# EAGLE schematic Specialist (EAGLE 6.4)

## Sheet 1 of 9
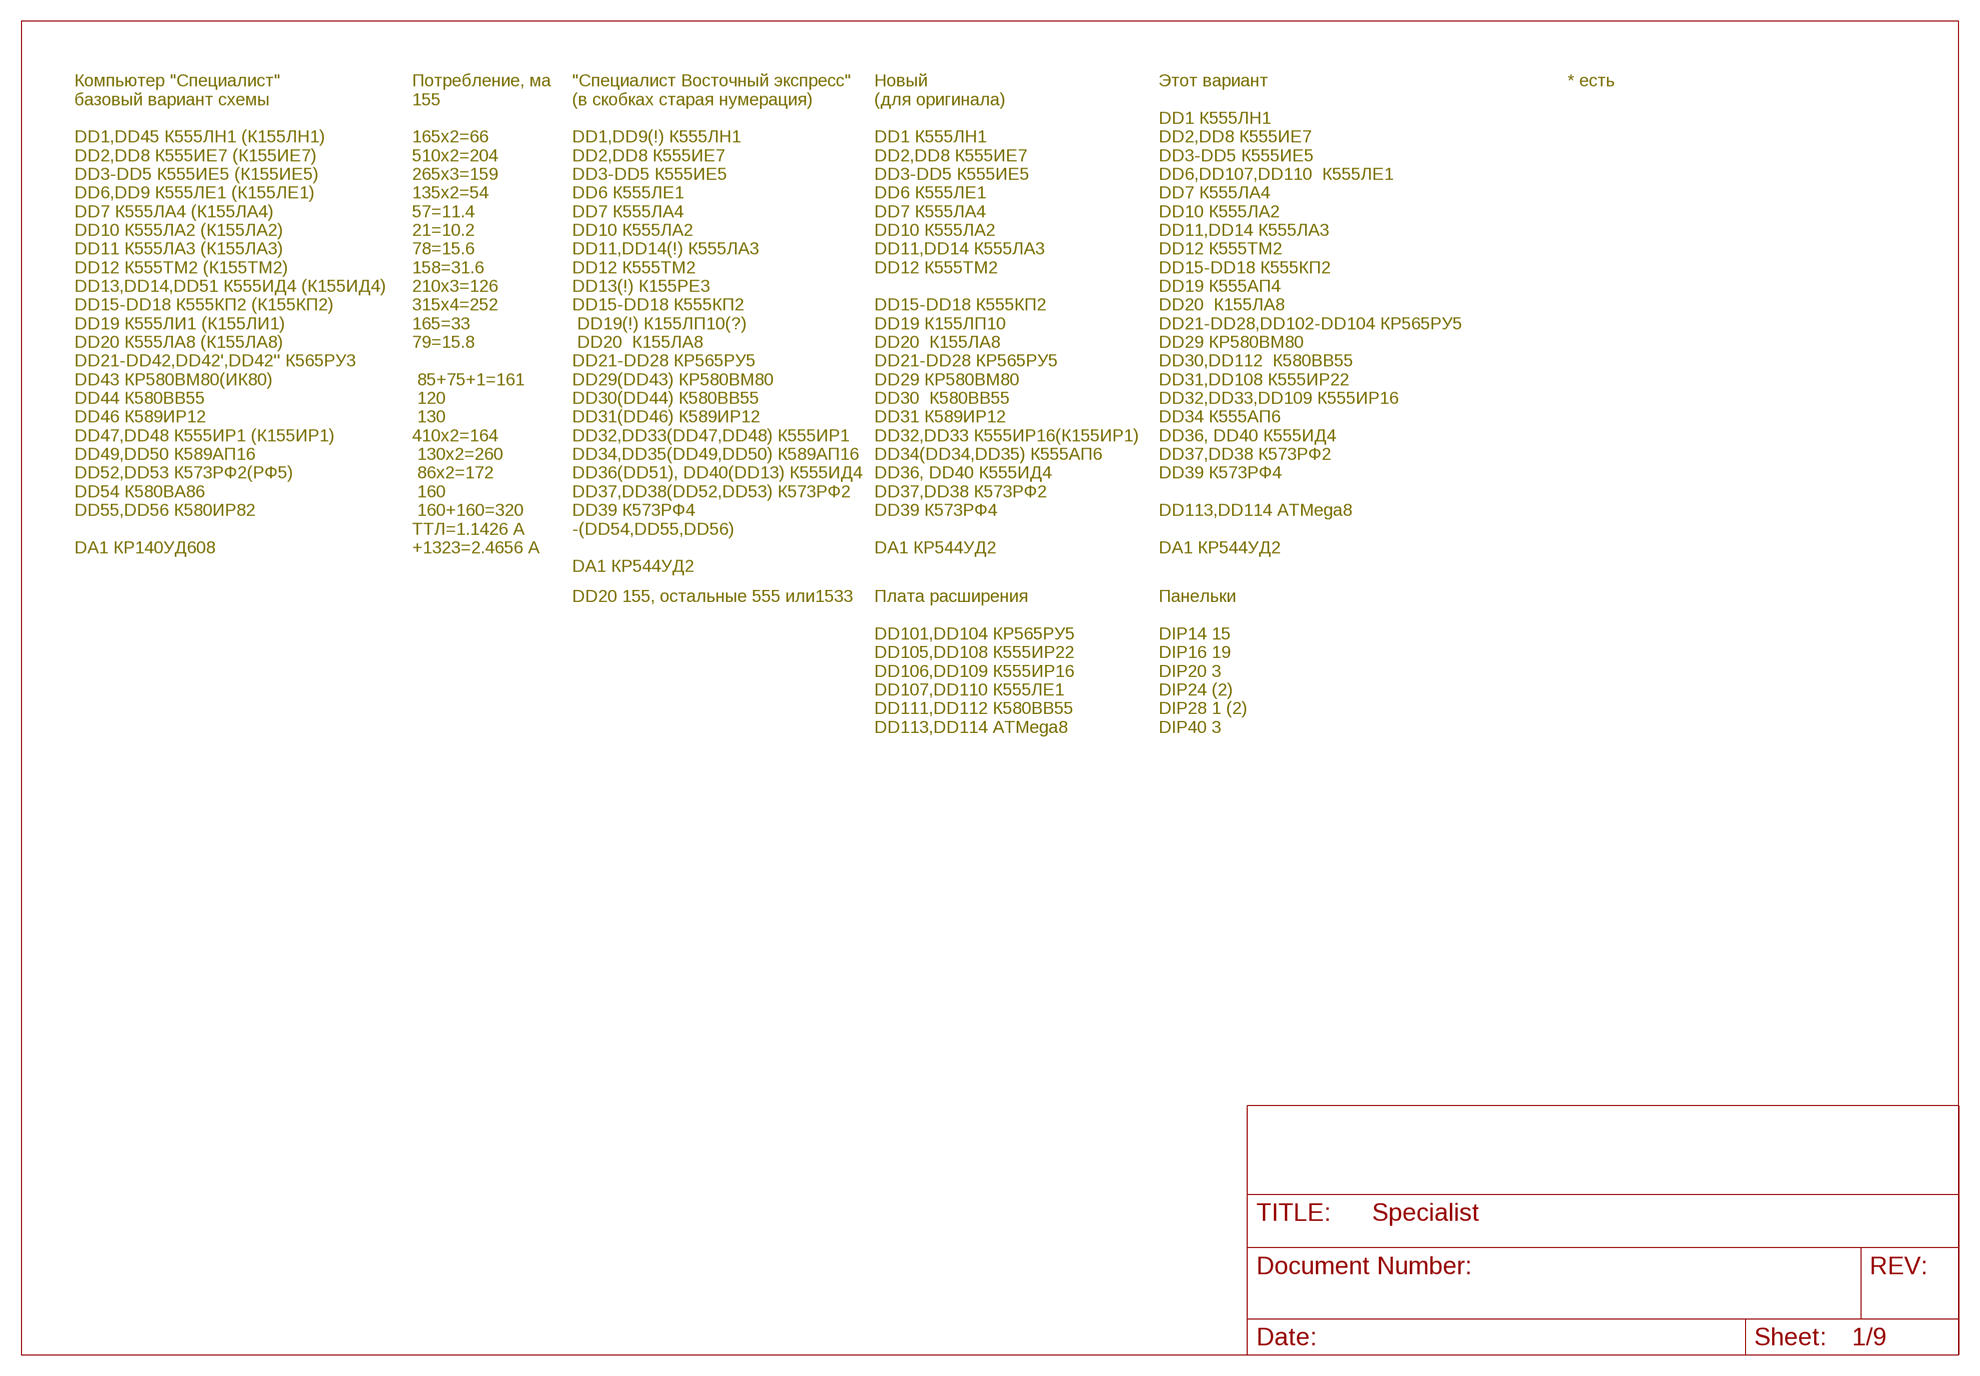
[diagram p0: schematic, sheet 1]

### Notes on the sheet
- Компьютер "Специалист"
  базовый вариант схемы
  
  DD1,DD45 К555ЛН1 (К155ЛН1)
  DD2,DD8 К555ИЕ7 (К155ИЕ7)
  DD3-DD5 К555ИЕ5 (К155ИЕ5)
  DD6,DD9 К555ЛЕ1 (К155ЛЕ1)
  DD7 К555ЛА4 (К155ЛА4)
  DD10 К555ЛА2 (К155ЛА2)
  DD11 К555ЛА3 (К155ЛА3)
  DD12 К555ТМ2 (К155ТМ2)
  DD13,DD14,DD51 К555ИД4 (К155ИД4)
  DD15-DD18 К555КП2 (К155КП2)
  DD19 К555ЛИ1 (К155ЛИ1)
  DD20 К555ЛА8 (К155ЛА8)
  DD21-DD42,DD42',DD42'' К565РУ3
  DD43 КР580ВМ80(ИК80)
  DD44 К580ВВ55
  DD46 К589ИР12
  DD47,DD48 К555ИР1 (К155ИР1)
  DD49,DD50 К589АП16
  DD52,DD53 К573РФ2(РФ5)
  DD54 К580ВА86
  DD55,DD56 К580ИР82
  
  DA1 КР140УД608
- Потребление, ма
  155 
  
  165х2=66
  510х2=204
  265х3=159
  135х2=54
  57=11.4
  21=10.2
  78=15.6
  158=31.6
  210х3=126
  315х4=252
  165=33
  79=15.8
  
   85+75+1=161
   120
   130
  410х2=164
   130х2=260
   86х2=172
   160
   160+160=320
  ТТЛ=1.1426 А
  +1323=2.4656 А
- "Специалист Восточный экспресс"
  (в скобках старая нумерация)
  
  DD1,DD9(!) К555ЛН1
  DD2,DD8 К555ИЕ7
  DD3-DD5 К555ИЕ5
  DD6 К555ЛЕ1
  DD7 К555ЛА4
  DD10 К555ЛА2
  DD11,DD14(!) К555ЛА3
  DD12 К555ТМ2
  DD13(!) К155РЕ3
  DD15-DD18 К555КП2
   DD19(!) К155ЛП10(?)
   DD20  К155ЛА8
  DD21-DD28 КР565РУ5
  DD29(DD43) КР580ВМ80
  DD30(DD44) К580ВВ55
  DD31(DD46) К589ИР12
  DD32,DD33(DD47,DD48) К555ИР1
  DD34,DD35(DD49,DD50) К589АП16
  DD36(DD51), DD40(DD13) К555ИД4 
  DD37,DD38(DD52,DD53) К573РФ2
  DD39 К573РФ4
  -(DD54,DD55,DD56)
  
  DA1 КР544УД2
- Новый
  (для оригинала)
  
  DD1 К555ЛН1
  DD2,DD8 К555ИЕ7
  DD3-DD5 К555ИЕ5
  DD6 К555ЛЕ1
  DD7 К555ЛА4
  DD10 К555ЛА2
  DD11,DD14 К555ЛА3
  DD12 К555ТМ2
  
  DD15-DD18 К555КП2
  DD19 К155ЛП10
  DD20  К155ЛА8
  DD21-DD28 КР565РУ5
  DD29 КР580ВМ80
  DD30  К580ВВ55
  DD31 К589ИР12
  DD32,DD33 К555ИР16(К155ИР1)
  DD34(DD34,DD35) К555АП6
  DD36, DD40 К555ИД4 
  DD37,DD38 К573РФ2
  DD39 К573РФ4
  
  DA1 КР544УД2
- Этот вариант
  
  DD1 К555ЛН1
  DD2,DD8 К555ИЕ7
  DD3-DD5 К555ИЕ5
  DD6,DD107,DD110  К555ЛЕ1
  DD7 К555ЛА4
  DD10 К555ЛА2
  DD11,DD14 К555ЛА3
  DD12 К555ТМ2
  DD15-DD18 К555КП2
  DD19 К555АП4
  DD20  К155ЛА8
  DD21-DD28,DD102-DD104 КР565РУ5
  DD29 КР580ВМ80
  DD30,DD112  К580ВВ55
  DD31,DD108 К555ИР22
  DD32,DD33,DD109 К555ИР16
  DD34 К555АП6
  DD36, DD40 К555ИД4 
  DD37,DD38 К573РФ2
  DD39 К573РФ4
  
  DD113,DD114 ATMega8
  
  DA1 КР544УД2
- * есть
- DD20 155, остальные 555 или1533
- Плата расширения
  
  DD101,DD104 КР565РУ5
  DD105,DD108 К555ИР22
  DD106,DD109 К555ИР16
  DD107,DD110 К555ЛЕ1
  DD111,DD112 К580ВВ55
  DD113,DD114 ATMega8
- Панельки
  
  DIP14 15
  DIP16 19
  DIP20 3
  DIP24 (2)
  DIP28 1 (2)
  DIP40 3

## Sheet 2 of 9: PWR
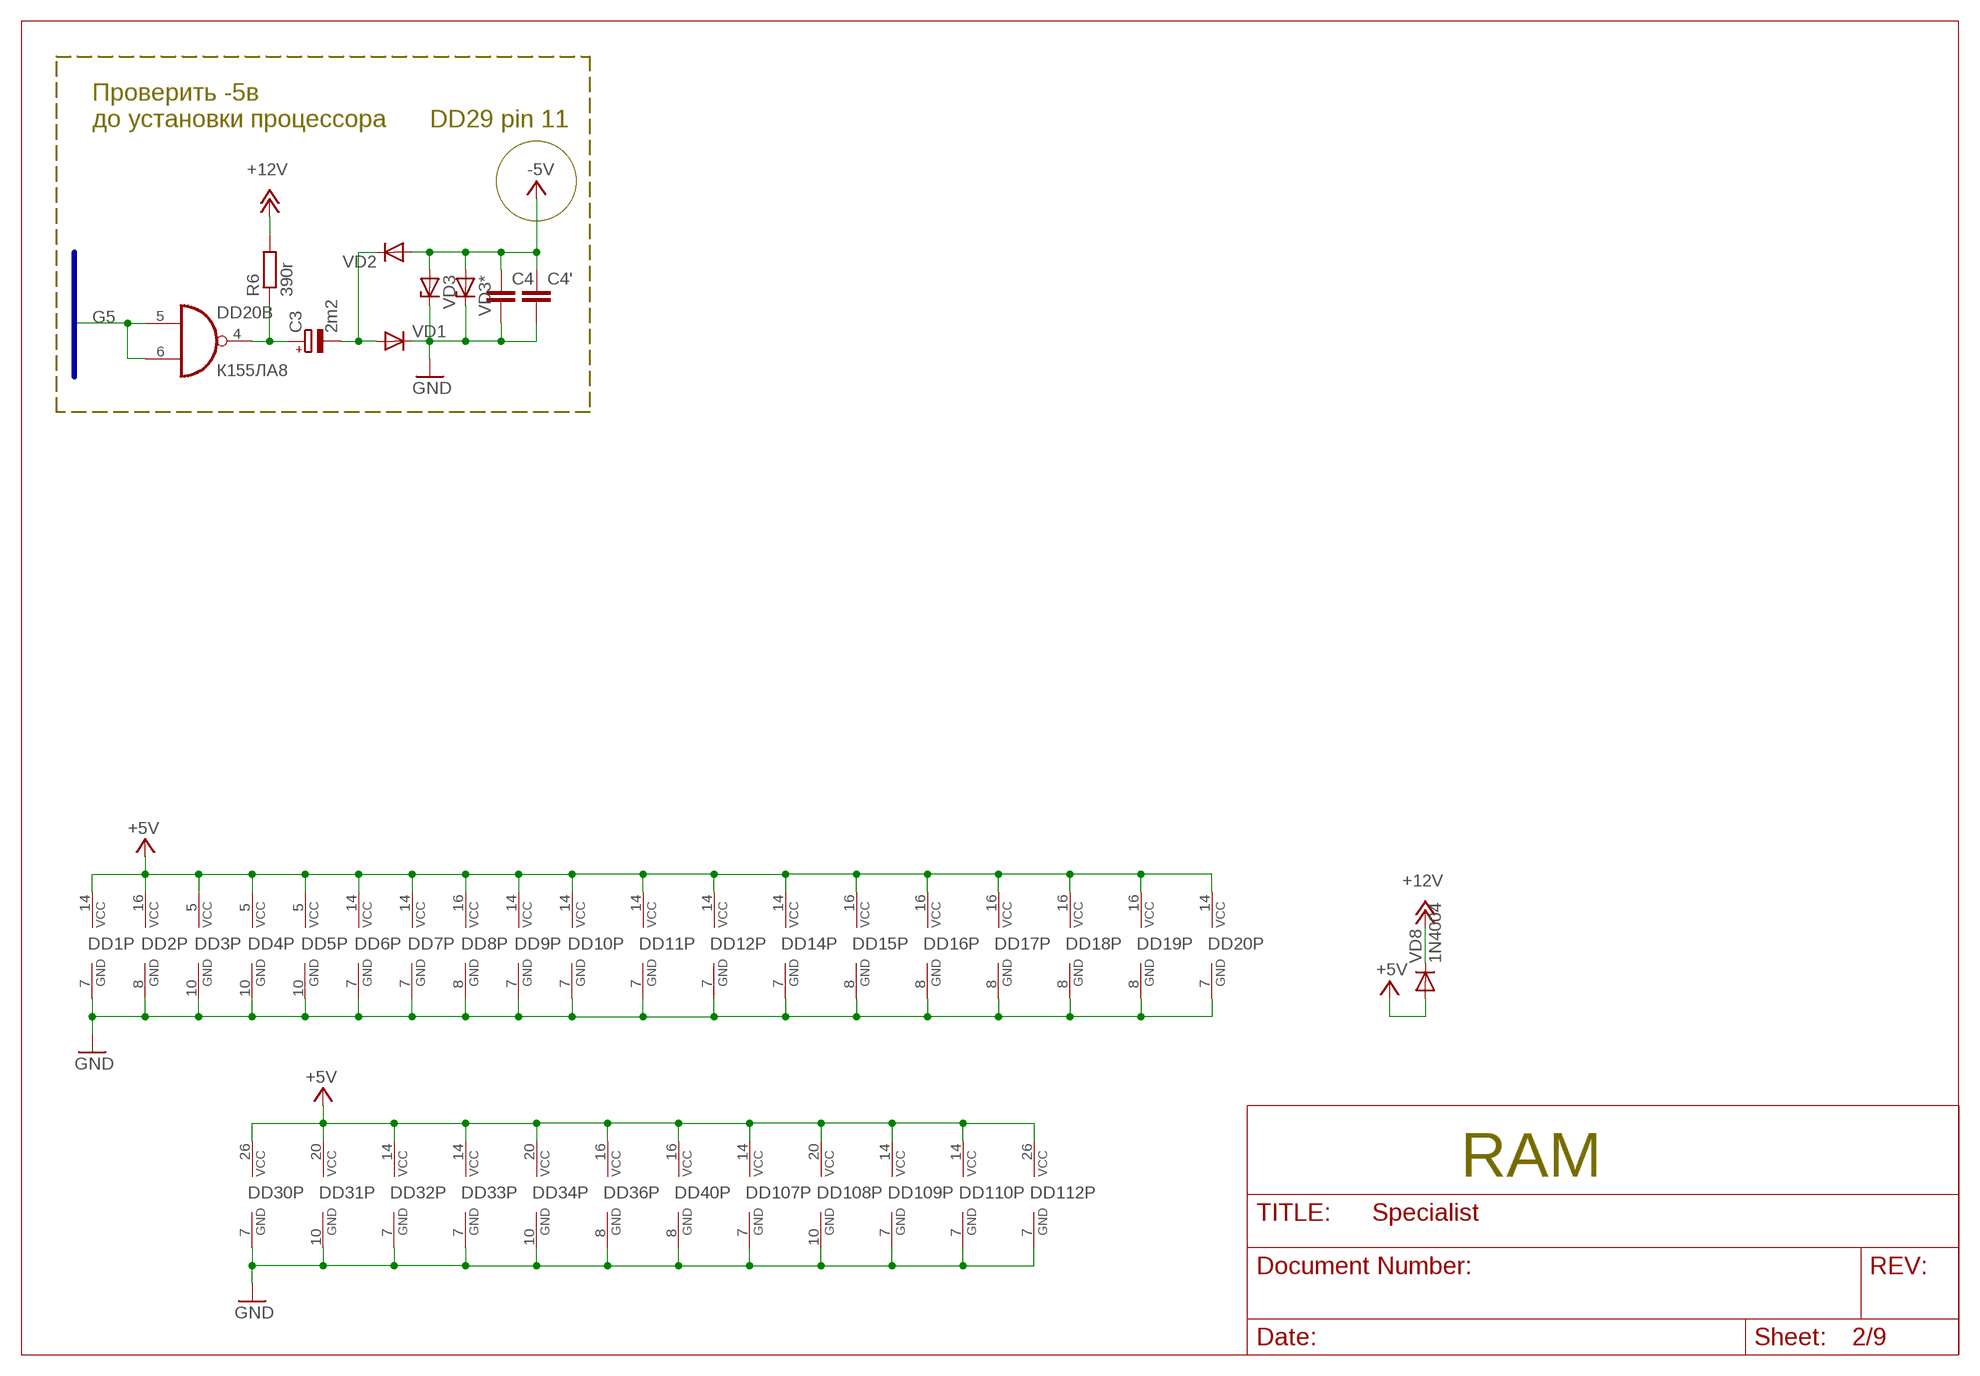
[diagram p1: schematic, sheet 2]

### Parts
C3  2m2  CPOL-EUE2.5-5  [E2,5-5]
C4  C-EUC1206  [C1206]
C4'  C-EUC1206  [C1206]
DD1  К155ЛН1  7404N  [DIL14]
DD2  К155ИЕ7  74192N  [DIL16]
DD3  К155ИЕ5  74LS93N  [DIL14]
DD4  К155ИЕ5  74LS93N  [DIL14]
DD5  К155ИЕ5  74LS93N  [DIL14]
DD6  К155ЛЕ1  7402N  [DIL14]
DD7  К155ЛА4  7410N  [DIL14]
DD8  К155ИЕ7  74192N  [DIL16]
DD9  К155ЛН1  7404N  [DIL14]
DD10  К155ЛА2  7430N  [DIL14]
DD11  К155ЛА3  7400N  [DIL14]
DD12  К155ТМ2  74S74N  [DIL14]
DD14  К155ЛА3  7400N  [DIL14]
DD15  К155КП2  74S153N  [DIL16]
DD16  К155КП2  74S153N  [DIL16]
DD17  К155КП2  74S153N  [DIL16]
DD18  К155КП2  74S153N  [DIL16]
DD19  К155ЛП10  74LS365N  [DIL16]
DD20  К155ЛА8  74LS01N  [DIL14]
DD30  КР580ВВ55  8255A  [DIL40]
DD31  К555ИР22  74LS373N  [DIL20]
DD32  К555ИР16  7495N  [DIL14]
DD33  К555ИР16  7495N  [DIL14]
DD34  К555АП6  74LS245N  [DIL20]
DD36  К155ИД4  74LS155N  [DIL16]
DD40  К155ИД4  74LS155N  [DIL16]
DD107  К155ЛЕ1  7402N  [DIL14]
DD108  К555ИР22  74LS373N  [DIL20]
DD109  К555ИР16  7495N  [DIL14]
DD110  К155ЛЕ1  7402N  [DIL14]
DD112  КР580ВВ55  8255A  [DIL40]
R6  390r  R-EU_0411/15  [0411/15]
VD1  DIODE-SOD80C  [SOD80C]
VD2  DIODE-SOD80C  [SOD80C]
VD3  ZENER-DIODESOD80C  [SOD80C]
VD3*  ZENER-DIODESOD80C  [SOD80C]
VD8  1N4004  [DO41-10]

### Nets
+5V: DD1.14(P:VCC) DD2.16(VCC) DD3.5(VCC) DD4.5(VCC) DD5.5(VCC) DD6.14(P:VCC) DD7.14(P:VCC) DD8.16(VCC) DD9.14(P:VCC) DD10.14(VCC) DD11.14(P:VCC) DD12.14(P:VCC) DD14.14(P:VCC) DD15.16(VCC) DD16.16(VCC) DD17.16(VCC) DD18.16(VCC) DD19.16(VCC) DD20.14(P:VCC) DD30.26(VCC) DD31.20(VCC) DD32.14(VCC) DD33.14(VCC) DD34.20(VCC) DD36.16(VCC) DD40.16(VCC) DD107.14(P:VCC) DD108.20(VCC) DD109.14(VCC) DD110.14(P:VCC) DD112.26(VCC) VD8.A ; also sheet 3,4,5,6,8,9
+12V: R6.2 VD8.C ; also sheet 3,5
-5V: C4'.1 C4.1 VD2.A VD3*.A VD3.A ; also sheet 5
G5: DD20.5(B:I0) DD20.6(B:I1) ; also sheet 3,6
GND: C4'.2 C4.2 DD1.7(P:GND) DD2.8(GND) DD3.10(GND) DD4.10(GND) DD5.10(GND) DD6.7(P:GND) DD7.7(P:GND) DD8.8(GND) DD9.7(P:GND) DD10.7(GND) DD11.7(P:GND) DD12.7(P:GND) DD14.7(P:GND) DD15.8(GND) DD16.8(GND) DD17.8(GND) DD18.8(GND) DD19.8(GND) DD20.7(P:GND) DD30.7(GND) DD31.10(GND) DD32.7(GND) DD33.7(GND) DD34.10(GND) DD36.8(GND) DD40.8(GND) DD107.7(P:GND) DD108.10(GND) DD109.7(GND) DD110.7(P:GND) DD112.7(GND) VD1.C VD3*.C VD3.C ; also sheet 3,4,5,6,8,9
N$21: C3.+ DD20.4(B:O) R6.1
N$22: C3.- VD1.A VD2.C
Unconnected: DD9.8(D:O) DD9.9(D:I) DD9.10(E:O) DD9.11(E:I) DD11.4(B:I0) DD11.5(B:I1) DD11.6(B:O) DD19.1(G1) DD19.2(A1) DD19.3(Y1) DD19.4(A2) DD19.5(Y2) DD19.6(A3) DD19.7(Y3) DD19.9(Y4) DD19.10(A4) DD19.11(Y5) DD19.12(A5) DD19.13(Y6) DD19.14(A6) DD19.15(G2)

### Buses
A[0..15],A'[11..15],D[0..7],F[1..2],G[1..19],!G19A,MA[0..7],MD[0..7],VD[0..11],K[1..27],!RAS,!CAS,CLK,!WE,!WR,X-----X,U7,!U[6..7],!RESIN,RES,RES80,RD,!RD,SNY,STRT,B,G,R,BO,GO,RO,SND,VID,LED,P[1..24],CRG,CS,!R,SH,TON,Q3,MOSI,MISO,SCK

### Notes on the sheet
- Проверить -5в 
  до установки процессора
- DD29 pin 11
- RAM

## Sheet 3 of 9: GEN
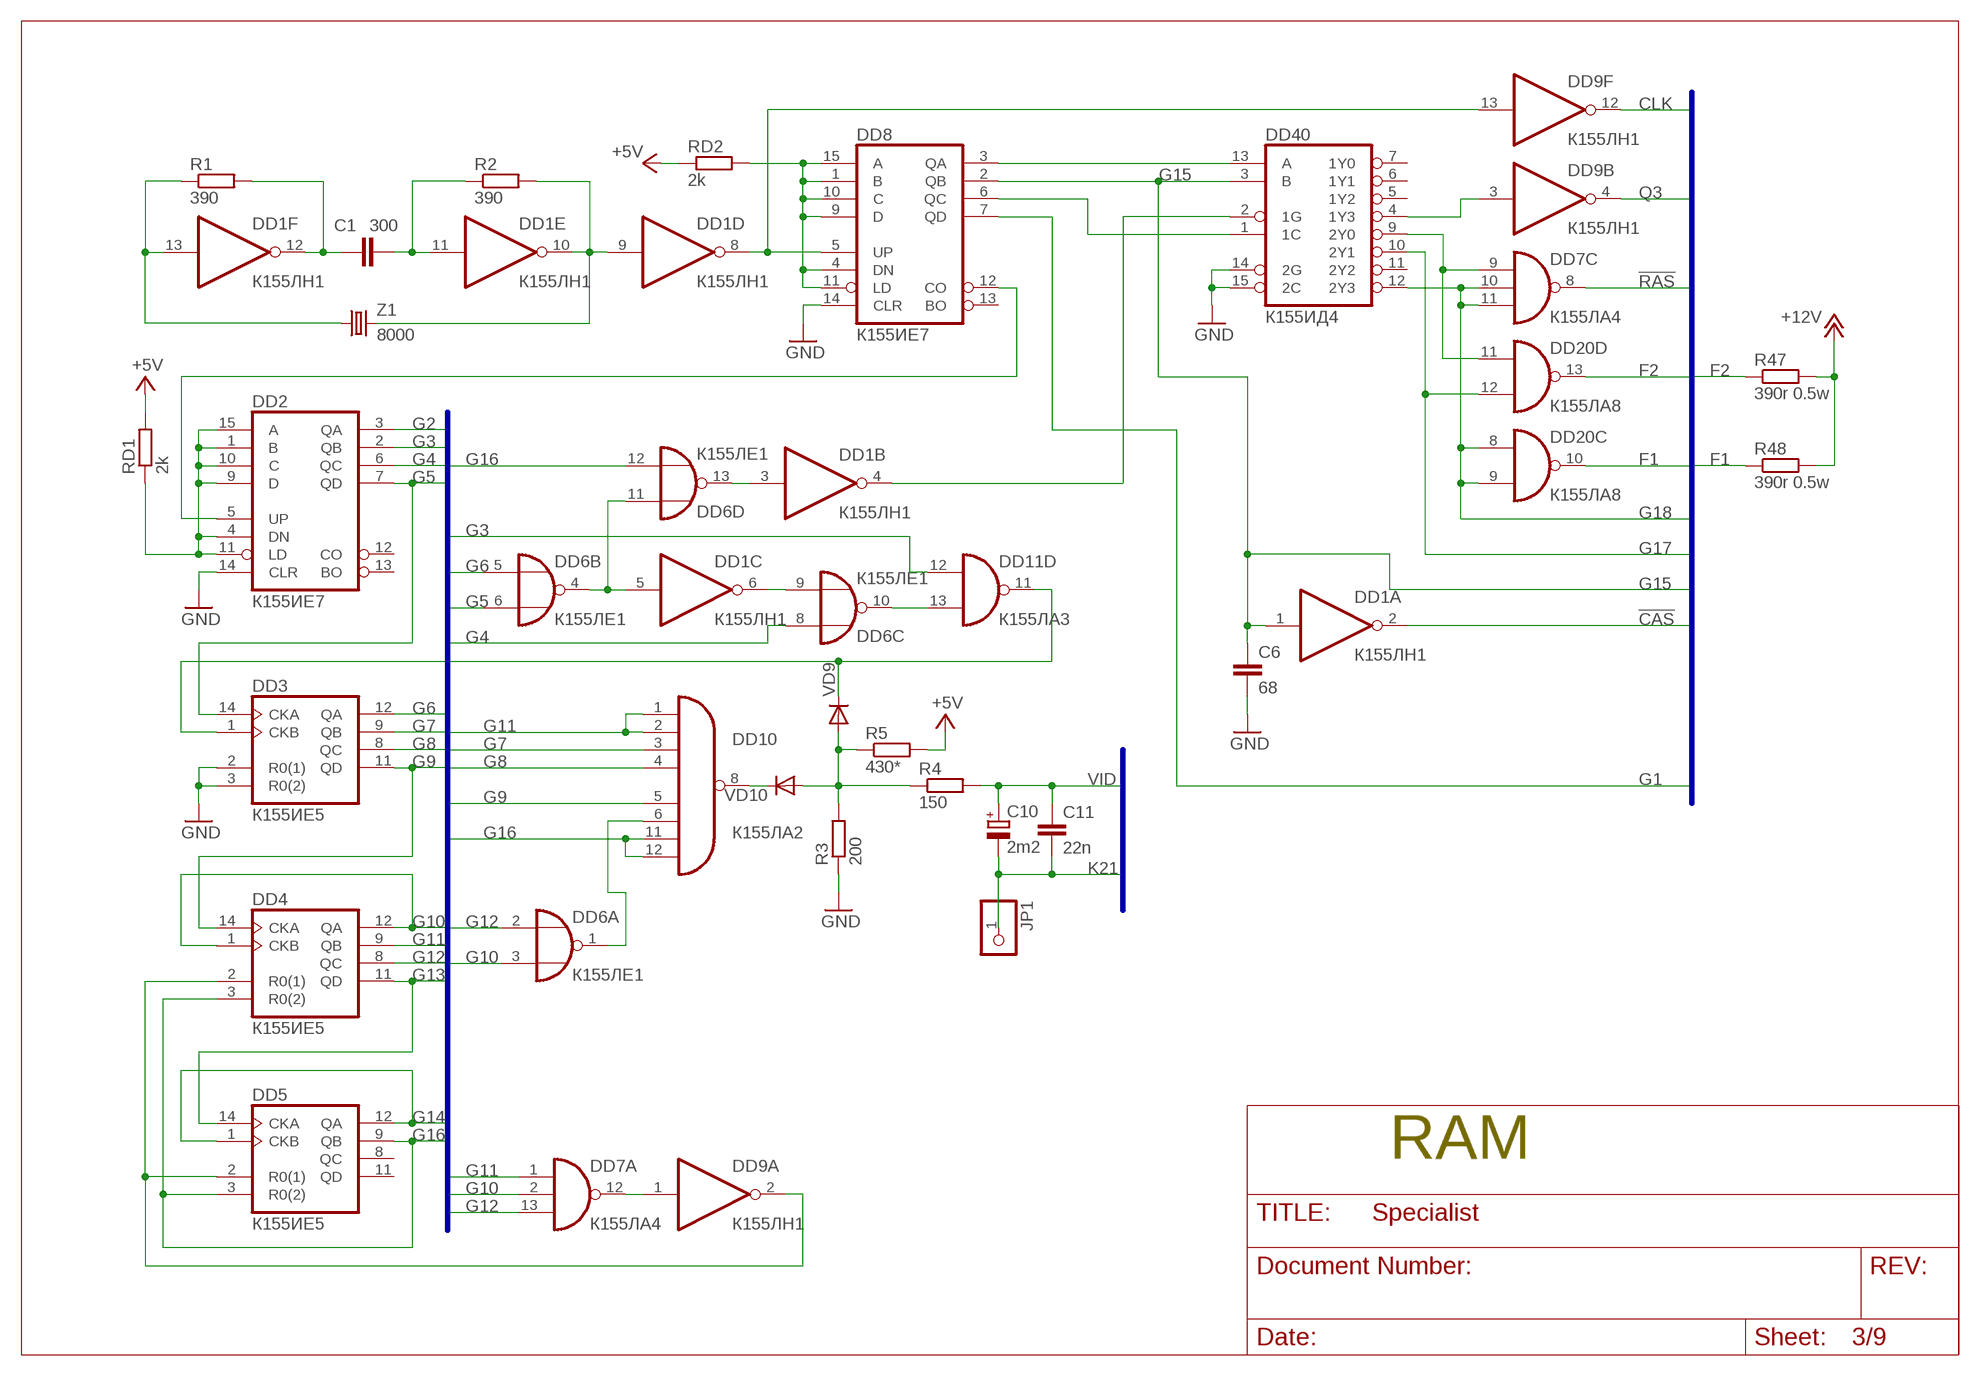
[diagram p2: schematic, sheet 3]

### Parts
C1  300  C-EUC0805  [C0805]
C6  68  C-EUC0805  [C0805]
C10  2m2  CPOL-EUE2.5-5  [E2,5-5]
C11  22n  C-EUC0805  [C0805]
JP1  PINHD-1X1  [1X01]
R1  390  R-EU_M1206  [M1206]
R2  390  R-EU_M1206  [M1206]
R3  200  R-EU_M1206  [M1206]
R4  150  R-EU_M1206  [M1206]
R5  430*  R-EU_M1206  [M1206]
R47  390r 0.5w  R-EU_0411/15  [0411/15]
R48  390r 0.5w  R-EU_0411/15  [0411/15]
RD1  2k  R-EU_M1206  [M1206]
RD2  2k  R-EU_M1206  [M1206]
VD9  DIODE-SOD80C  [SOD80C]
VD10  DIODE-SOD80C  [SOD80C]
Z1  8000  CRYSTALHC49S  [HC49/S]

### Nets
!CAS: DD1.2(A:O) ; also sheet 4,6
!RAS: DD7.8(C:O) ; also sheet 4,6
+5V: R5.2 RD1.2 RD2.1 ; also sheet 2,4,5,6,8,9
+12V: R47.2 R48.2 ; also sheet 2,5
CLK: DD9.12(F:O) ; also sheet 4
F1: DD20.10(C:O) R48.1 ; also sheet 5
F2: DD20.13(D:O) R47.1 ; also sheet 5
G1: DD8.7(QD) ; also sheet 6
G2: DD2.3(QA) ; also sheet 6
G3: DD2.2(QB) DD11.12(D:I0) ; also sheet 6
G4: DD2.6(QC) DD6.8(C:I0) ; also sheet 6
G5: DD2.7(QD) DD3.14(CKA) DD6.6(B:I1) ; also sheet 2,6
G6: DD3.12(QA) DD6.5(B:I0) ; also sheet 6
G7: DD3.9(QB) DD10.3(I2) ; also sheet 6
G8: DD3.8(QC) DD10.4(I3) ; also sheet 6
G9: DD3.11(QD) DD4.14(CKA) DD10.5(I4) ; also sheet 6
G10: DD4.1(CKB) DD4.12(QA) DD6.3(A:I1) DD7.2(A:I1) ; also sheet 6
G11: DD4.9(QB) DD7.1(A:I0) DD10.1(I0) DD10.2(I1) ; also sheet 6
G12: DD4.8(QC) DD6.2(A:I0) DD7.13(A:I2) ; also sheet 6
G13: DD4.11(QD) DD5.14(CKA) ; also sheet 6
G14: DD5.1(CKB) DD5.12(QA) ; also sheet 6
G15: C6.1 DD1.1(A:I) DD8.2(QB) DD40.3(B) ; also sheet 6
G16: DD4.3(R0(2)) DD5.3(R0(2)) DD5.9(QB) DD6.12(D:I1) DD10.11(I6) DD10.12(I7) ; also sheet 5
G17: DD20.12(D:I1) DD40.10(2Y1) ; also sheet 5
G18: DD7.10(C:I1) DD7.11(C:I2) DD20.8(C:I0) DD20.9(C:I1) DD40.12(2Y3) ; also sheet 5
GND: C6.2 DD2.14(CLR) DD3.2(R0(1)) DD3.3(R0(2)) DD8.14(CLR) DD40.14(2G) DD40.15(2C) R3.1 ; also sheet 2,4,5,6,8,9
K21: C10.- C11.2 JP1.1
N$1: DD6.10(C:O) DD11.13(D:I1)
N$2: DD1.5(C:I) DD6.4(B:O) DD6.11(D:I0)
N$3: DD1.13(F:I) R1.1 Z1.1
N$4: DD9.3(B:I) DD40.4(1Y3)
N$5: C1.1 DD1.12(F:O) R1.2
N$6: DD1.9(D:I) DD1.10(E:O) R2.2 Z1.2
N$7: C1.2 DD1.11(E:I) R2.1
N$8: DD1.8(D:O) DD8.5(UP) DD9.13(F:I)
N$11: DD2.5(UP) DD8.12(CO)
N$12: DD6.1(A:O) DD10.6(I5)
N$13: DD1.6(C:O) DD6.9(C:I1)
N$14: DD1.3(B:I) DD6.13(D:O)
N$16: DD4.2(R0(1)) DD5.2(R0(1)) DD9.2(A:O)
N$19: DD7.9(C:I0) DD20.11(D:I0) DD40.9(2Y0)
N$20: DD8.3(QA) DD40.13(A)
N$23: DD8.6(QC) DD40.1(1C)
N$24: DD1.4(B:O) DD40.2(1G)
N$25: DD10.8(O) VD10.C
N$26: DD3.1(CKB) DD11.11(D:O) VD9.C
N$27: R3.2 R4.1 R5.1 VD9.A VD10.A
N$29: DD2.1(B) DD2.4(DN) DD2.9(D) DD2.10(C) DD2.11(LD) DD2.15(A) RD1.1
N$37: DD7.12(A:O) DD9.1(A:I)
N$38: DD8.1(B) DD8.4(DN) DD8.9(D) DD8.10(C) DD8.11(LD) DD8.15(A) RD2.2
Q3: DD9.4(B:O) ; also sheet 4
VID: C10.+ C11.1 R4.2 ; also sheet 4
Unconnected: DD2.12(CO) DD2.13(BO) DD5.8(QC) DD5.11(QD) DD8.13(BO) DD40.5(1Y2) DD40.6(1Y1) DD40.7(1Y0) DD40.11(2Y2)

### Buses
A[0..15],A'[11..15],D[0..7],F[1..2],G[1..19],!G19A,MA[0..7],MD[0..7],VD[0..11],K[1..27],!RAS,!CAS,CLK,!WE,!WR,X-----X,U7,!U[6..7],!RESIN,RES,RES80,RD,!RD,SNY,STRT,B,G,R,BO,GO,RO,SND,VID,LED,P[1..24],CRG,CS,!R,SH,TON,Q3,MOSI,MISO,SCK

### Notes on the sheet
- RAM

## Sheet 4 of 9: Video
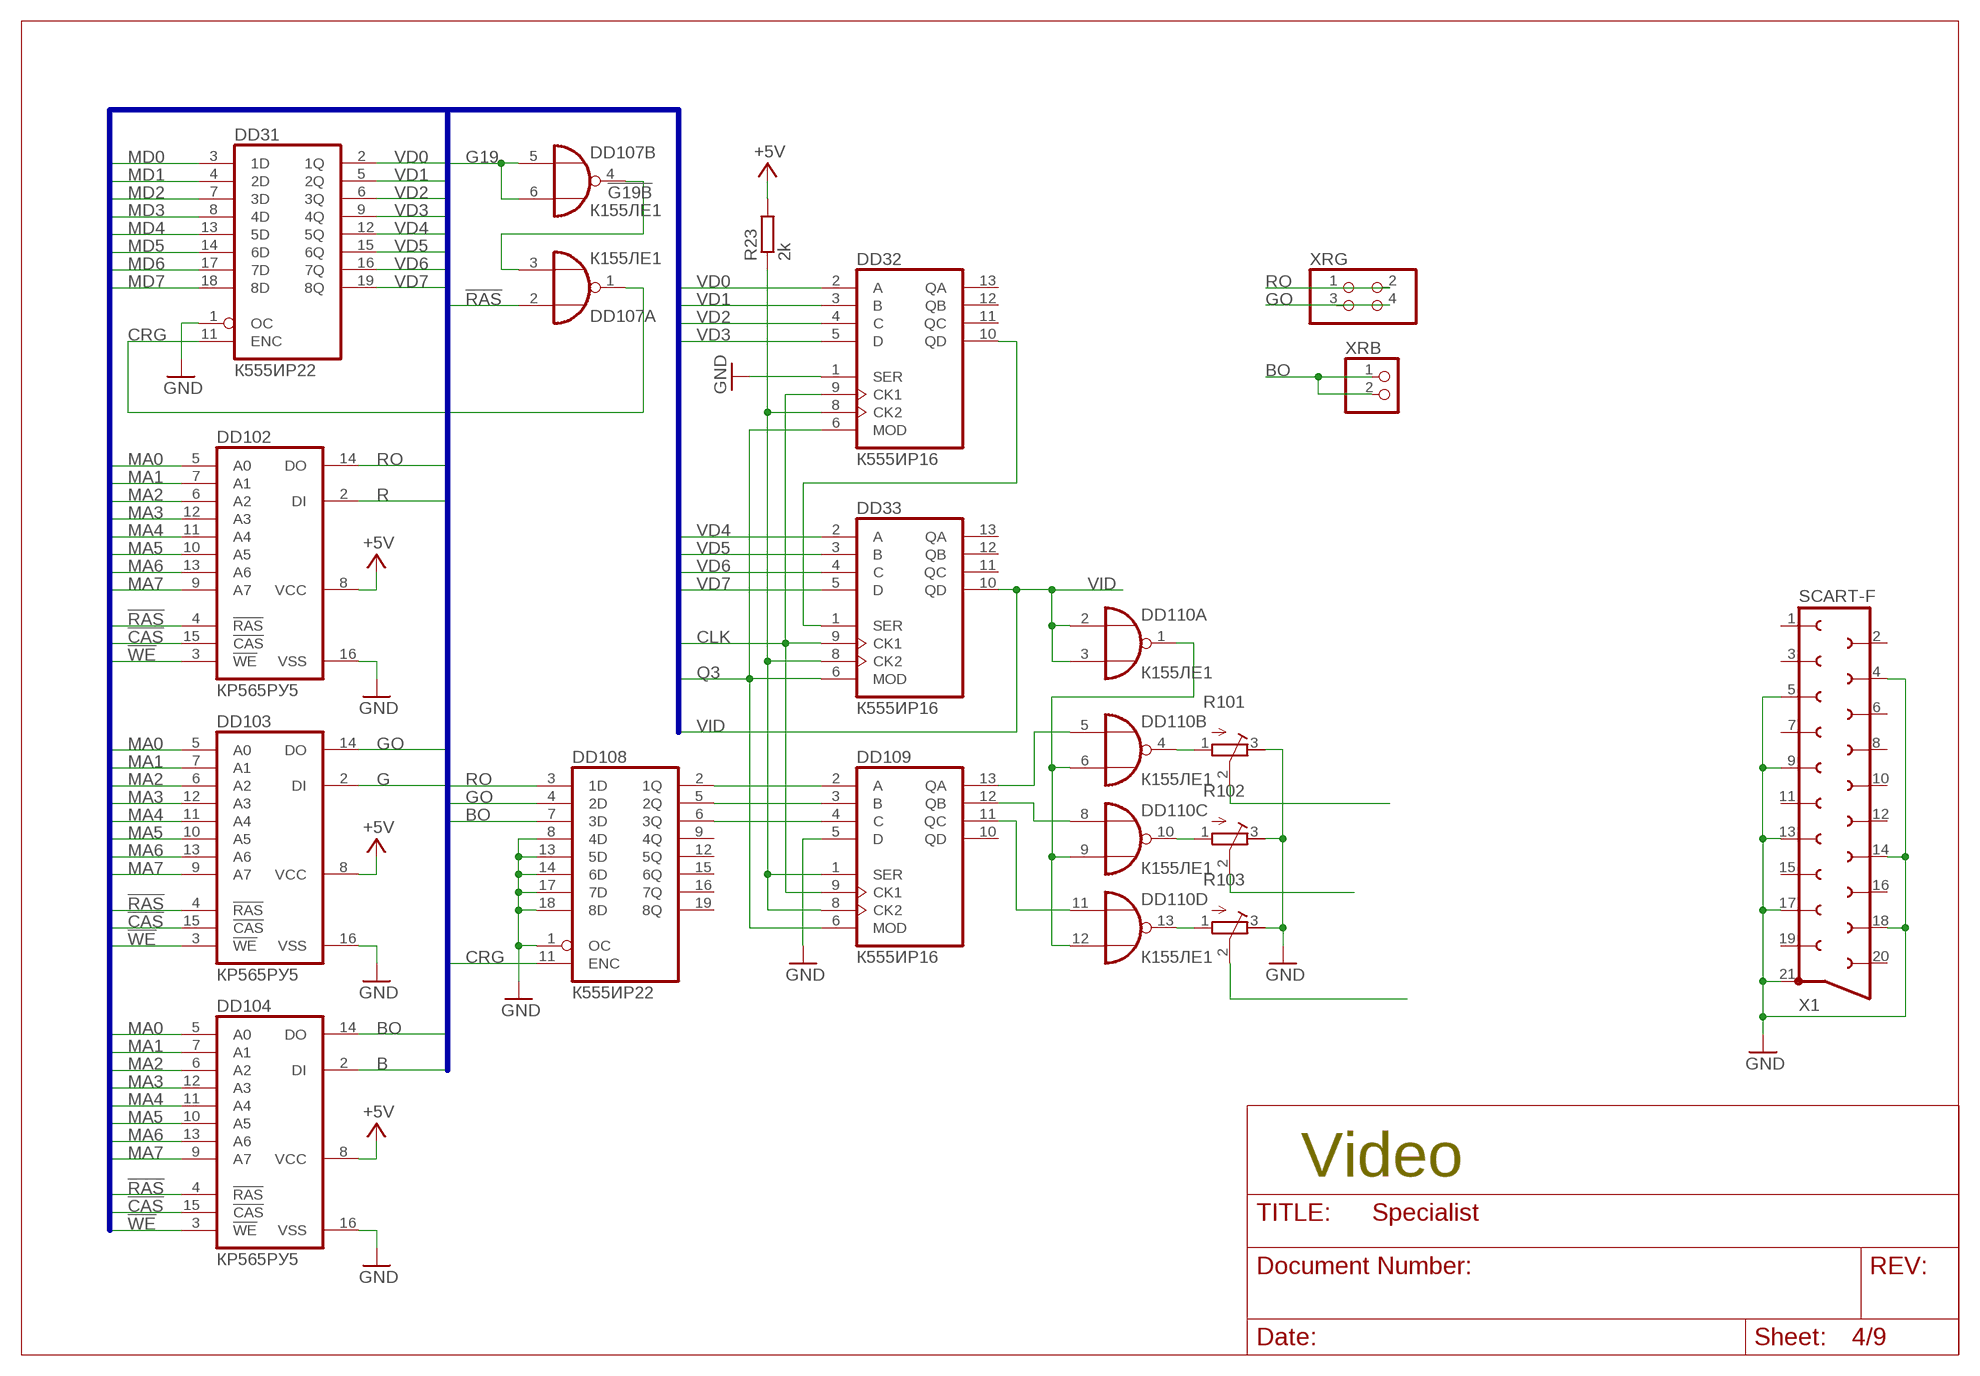
[diagram p3: schematic, sheet 4]

### Parts
DD102  КР565РУ5  2164  [DIL16]
DD103  КР565РУ5  2164  [DIL16]
DD104  КР565РУ5  2164  [DIL16]
R23  2k  R-EU_M1206  [M1206]
R101  R-TRIMM3296W  [RTRIM3296W]
R102  R-TRIMM3296W  [RTRIM3296W]
R103  R-TRIMM3296W  [RTRIM3296W]
X1  SCART-F  [SCART-F]
XRB  PINHD-1X2  [2X01]
XRG  PINHD-2X2  [2X02]

### Nets
!CAS: DD102.15(!CAS) DD103.15(!CAS) DD104.15(!CAS) ; also sheet 3,6
!G19B: DD107.3(A:I1) DD107.4(B:O)
!RAS: DD102.4(!RAS) DD103.4(!RAS) DD104.4(!RAS) DD107.2(A:I0) ; also sheet 3,6
!WE: DD102.3(!WE) DD103.3(!WE) DD104.3(!WE) ; also sheet 6
+5V: DD102.8(VCC) DD103.8(VCC) DD104.8(VCC) R23.2 ; also sheet 2,3,5,6,8,9
B: DD104.2(DI) ; also sheet 5,7,9
BO: DD104.14(DO) DD108.7(3D) XRB.1 XRB.2 ; also sheet 7
CLK: DD32.9(CK1) DD33.9(CK1) DD109.9(CK1) ; also sheet 3
CRG: DD31.11(ENC) DD107.1(A:O) DD108.11(ENC)
G: DD103.2(DI) ; also sheet 5,7,9
G19: DD107.5(B:I0) DD107.6(B:I1) ; also sheet 5,6
GND: DD31.1(OC) DD32.1(SER) DD102.16(VSS) DD103.16(VSS) DD104.16(VSS) DD108.1(OC) DD108.8(4D) DD108.13(5D) DD108.14(6D) DD108.17(7D) DD108.18(8D) DD109.5(D) R101.3(E) R102.3(E) R103.3(E) X1.4 X1.5 X1.9 X1.13 X1.14 X1.17 X1.18 X1.21 ; also sheet 2,3,5,6,8,9
GO: DD103.14(DO) DD108.4(2D) XRG.3 XRG.4 ; also sheet 7
MA0: DD102.5(A0) DD103.5(A0) DD104.5(A0) ; also sheet 6
MA1: DD102.7(A1) DD103.7(A1) DD104.7(A1) ; also sheet 6
MA2: DD102.6(A2) DD103.6(A2) DD104.6(A2) ; also sheet 6
MA3: DD102.12(A3) DD103.12(A3) DD104.12(A3) ; also sheet 6
MA4: DD102.11(A4) DD103.11(A4) DD104.11(A4) ; also sheet 6
MA5: DD102.10(A5) DD103.10(A5) DD104.10(A5) ; also sheet 6
MA6: DD102.13(A6) DD103.13(A6) DD104.13(A6) ; also sheet 6
MA7: DD102.9(A7) DD103.9(A7) DD104.9(A7) ; also sheet 6
MD0: DD31.3(1D) ; also sheet 6
MD1: DD31.4(2D) ; also sheet 6
MD2: DD31.7(3D) ; also sheet 6
MD3: DD31.8(4D) ; also sheet 6
MD4: DD31.13(5D) ; also sheet 6
MD5: DD31.14(6D) ; also sheet 6
MD6: DD31.17(7D) ; also sheet 6
MD7: DD31.18(8D) ; also sheet 6
N$28: DD32.10(QD) DD33.1(SER)
N$42: DD110.1(A:O) DD110.6(B:I1) DD110.9(C:I1) DD110.12(D:I1)
N$43: DD108.2(1Q) DD109.2(A)
N$45: DD108.5(2Q) DD109.3(B)
N$46: DD108.6(3Q) DD109.4(C)
N$50: DD109.13(QA) DD110.5(B:I0)
N$51: DD109.12(QB) DD110.8(C:I0)
N$52: DD109.11(QC) DD110.11(D:I0)
N$54: DD110.4(B:O) R101.1(A)
N$55: DD110.10(C:O) R102.1(A)
N$56: DD110.13(D:O) R103.1(A)
N$58: R101.2(S)
N$59: R102.2(S)
N$60: R103.2(S)
Q3: DD32.6(MOD) DD33.6(MOD) DD109.6(MOD) ; also sheet 3
R: DD102.2(DI) ; also sheet 5,7,9
R2: DD32.8(CK2) DD33.8(CK2) DD109.1(SER) DD109.8(CK2) R23.1
RO: DD102.14(DO) DD108.3(1D) XRG.1 XRG.2 ; also sheet 7
VD0: DD31.2(1Q) DD32.2(A)
VD1: DD31.5(2Q) DD32.3(B)
VD2: DD31.6(3Q) DD32.4(C)
VD3: DD31.9(4Q) DD32.5(D)
VD4: DD31.12(5Q) DD33.2(A)
VD5: DD31.15(6Q) DD33.3(B)
VD6: DD31.16(7Q) DD33.4(C)
VD7: DD31.19(8Q) DD33.5(D)
VID: DD33.10(QD) DD110.2(A:I0) DD110.3(A:I1) ; also sheet 3
Unconnected: DD32.11(QC) DD32.12(QB) DD32.13(QA) DD33.11(QC) DD33.12(QB) DD33.13(QA) DD108.9(4Q) DD108.12(5Q) DD108.15(6Q) DD108.16(7Q) DD108.19(8Q) DD109.10(QD) X1.1 X1.2 X1.3 X1.6 X1.7 X1.8 X1.10 X1.11 X1.12 X1.15 X1.16 X1.19 X1.20

### Buses
A[0..15],A'[11..15],D[0..7],F[1..2],G[1..19],!G19A,MA[0..7],MD[0..7],VD[0..11],K[1..27],!RAS,!CAS,CLK,!WE,!WR,X-----X,U7,!U[6..7],!RESIN,RES,RES80,RD,!RD,SNY,STRT,B,G,R,BO,GO,RO,SND,VID,LED,P[1..24],CRG,CS,!R,SH,TON,Q3,MOSI,MISO,SCK

### Notes on the sheet
- Video

## Sheet 5 of 9: CPU
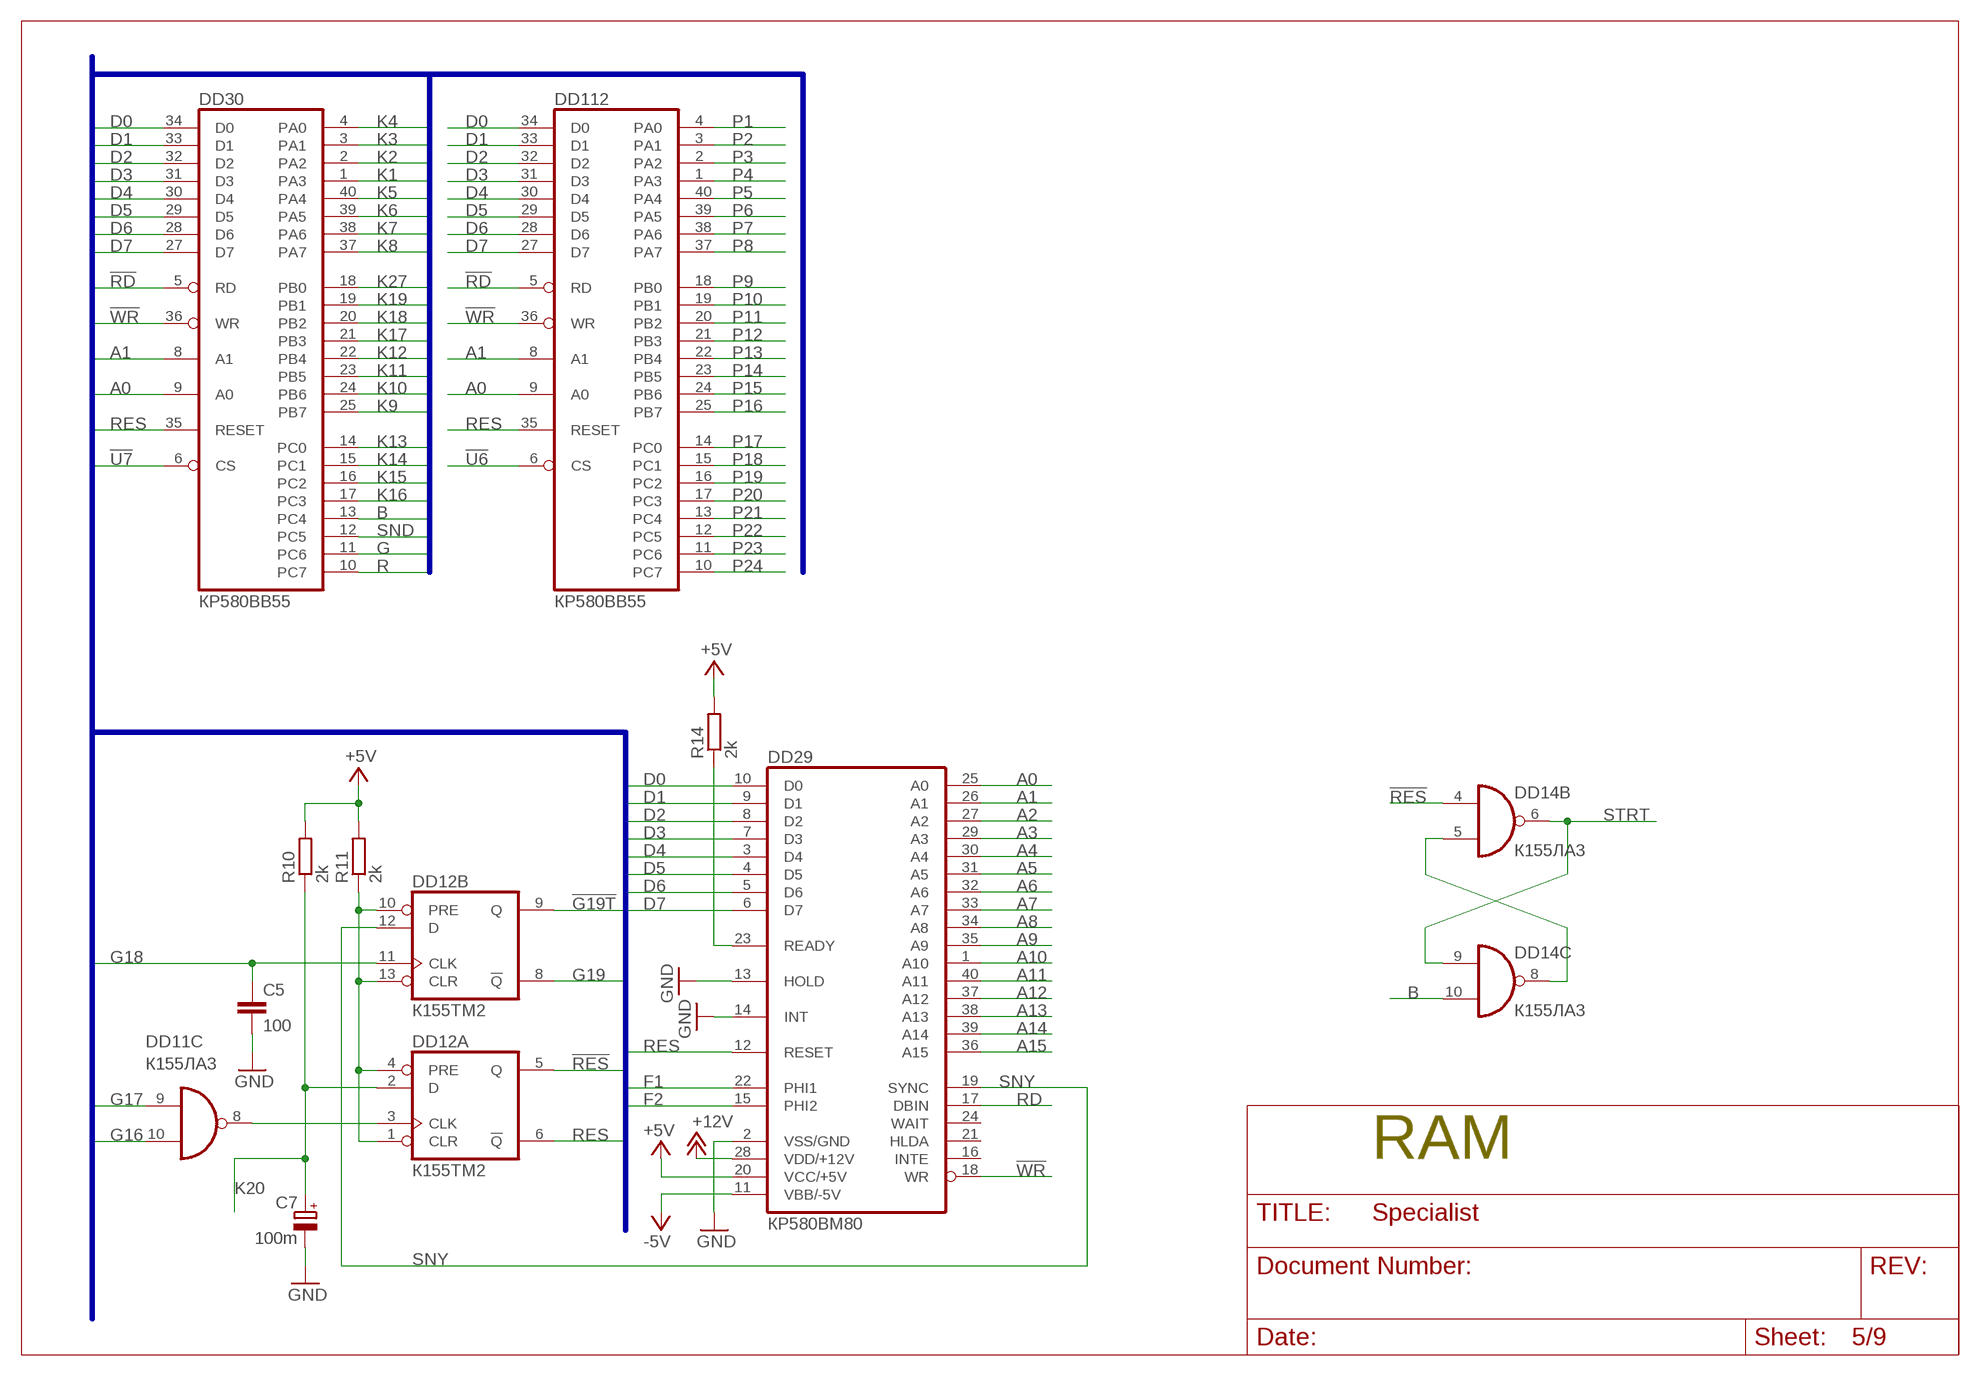
[diagram p4: schematic, sheet 5]

### Parts
C5  100  C-EUC0805  [C0805]
C7  100m  CPOL-EUE2.5-5  [E2,5-5]
DD29  КР580ВМ80  8080  [DIL40]
R10  2k  R-EU_M1206  [M1206]
R11  2k  R-EU_M1206  [M1206]
R14  2k  R-EU_M1206  [M1206]

### Nets
!G19T: DD12.9(B:Q) ; also sheet 6
!RD: DD30.5(RD) DD112.5(RD) ; also sheet 6,9
!RES: DD12.5(A:Q) DD14.4(B:I0)
!U6: DD112.6(CS) ; also sheet 8,9
!U7: DD30.6(CS) ; also sheet 9
!WR: DD29.18(WR) DD30.36(WR) DD112.36(WR) ; also sheet 9
+5V: DD29.20(VCC/+5V) R10.2 R11.2 R14.2 ; also sheet 2,3,4,6,8,9
+12V: DD29.28(VDD/+12V) ; also sheet 2,3
-5V: DD29.11(VBB/-5V) ; also sheet 2
A0: DD29.25(A0) DD30.9(A0) DD112.9(A0) ; also sheet 6,9
A1: DD29.26(A1) DD30.8(A1) DD112.8(A1) ; also sheet 6,9
A2: DD29.27(A2) ; also sheet 6
A3: DD29.29(A3) ; also sheet 6
A4: DD29.30(A4) ; also sheet 6
A5: DD29.31(A5) ; also sheet 6
A6: DD29.32(A6) ; also sheet 6
A7: DD29.33(A7) ; also sheet 6
A8: DD29.34(A8) ; also sheet 6
A9: DD29.35(A9) ; also sheet 6
A10: DD29.1(A10) ; also sheet 6
A11: DD29.40(A11) ; also sheet 6,8
A12: DD29.37(A12) ; also sheet 6,8
A13: DD29.38(A13) ; also sheet 6,8
A14: DD29.39(A14) ; also sheet 6,8
A15: DD29.36(A15) ; also sheet 6,8
B: DD14.10(C:I1) DD30.13(PC4) ; also sheet 4,7,9
D0: DD29.10(D0) DD30.34(D0) DD112.34(D0) ; also sheet 6,9
D1: DD29.9(D1) DD30.33(D1) DD112.33(D1) ; also sheet 6,9
D2: DD29.8(D2) DD30.32(D2) DD112.32(D2) ; also sheet 6,9
D3: DD29.7(D3) DD30.31(D3) DD112.31(D3) ; also sheet 6,9
D4: DD29.3(D4) DD30.30(D4) DD112.30(D4) ; also sheet 6,9
D5: DD29.4(D5) DD30.29(D5) DD112.29(D5) ; also sheet 6,9
D6: DD29.5(D6) DD30.28(D6) DD112.28(D6) ; also sheet 6,9
D7: DD29.6(D7) DD30.27(D7) DD112.27(D7) ; also sheet 6,9
F1: DD29.22(PHI1) ; also sheet 3
F2: DD29.15(PHI2) ; also sheet 3
G: DD30.11(PC6) ; also sheet 4,7,9
G16: DD11.10(C:I1) ; also sheet 3
G17: DD11.9(C:I0) ; also sheet 3
G18: C5.1 DD12.11(B:CLK) ; also sheet 3
G19: DD12.8(B:!Q) ; also sheet 4,6
GND: C5.2 C7.- DD29.2(VSS/GND) DD29.13(HOLD) DD29.14(INT) ; also sheet 2,3,4,6,8,9
K1: DD30.1(PA3) ; also sheet 9
K2: DD30.2(PA2) ; also sheet 9
K3: DD30.3(PA1) ; also sheet 9
K4: DD30.4(PA0) ; also sheet 9
K5: DD30.40(PA4) ; also sheet 9
K6: DD30.39(PA5) ; also sheet 9
K7: DD30.38(PA6) ; also sheet 9
K8: DD30.37(PA7) ; also sheet 9
K9: DD30.25(PB7) ; also sheet 9
K10: DD30.24(PB6) ; also sheet 9
K11: DD30.23(PB5) ; also sheet 9
K12: DD30.22(PB4) ; also sheet 9
K13: DD30.14(PC0) ; also sheet 9
K14: DD30.15(PC1) ; also sheet 9
K15: DD30.16(PC2) ; also sheet 9
K16: DD30.17(PC3) ; also sheet 9
K17: DD30.21(PB3) ; also sheet 9
K18: DD30.20(PB2) ; also sheet 9
K19: DD30.19(PB1) ; also sheet 9
K20: C7.+ DD12.2(A:D) R10.1
K27: DD30.18(PB0) ; also sheet 9
N$31: DD12.1(A:CLR) DD12.4(A:PRE) DD12.10(B:PRE) DD12.13(B:CLR) R11.1
N$34: DD11.8(C:O) DD12.3(A:CLK)
N$36: DD14.5(B:I1) DD14.8(C:O)
N$66: DD29.23(READY) R14.1
P1: DD112.4(PA0) ; also sheet 9
P2: DD112.3(PA1) ; also sheet 9
P3: DD112.2(PA2) ; also sheet 9
P4: DD112.1(PA3) ; also sheet 9
P5: DD112.40(PA4) ; also sheet 9
P6: DD112.39(PA5) ; also sheet 9
P7: DD112.38(PA6) ; also sheet 9
P8: DD112.37(PA7) ; also sheet 9
P9: DD112.18(PB0) ; also sheet 9
P10: DD112.19(PB1) ; also sheet 9
P11: DD112.20(PB2) ; also sheet 9
P12: DD112.21(PB3) ; also sheet 9
P13: DD112.22(PB4) ; also sheet 9
P14: DD112.23(PB5) ; also sheet 9
P15: DD112.24(PB6) ; also sheet 9
P16: DD112.25(PB7) ; also sheet 9
P17: DD112.14(PC0) ; also sheet 9
P18: DD112.15(PC1) ; also sheet 9
P19: DD112.16(PC2) ; also sheet 9
P20: DD112.17(PC3) ; also sheet 9
P21: DD112.13(PC4) ; also sheet 9
P22: DD112.12(PC5) ; also sheet 9
P23: DD112.11(PC6) ; also sheet 9
P24: DD112.10(PC7) ; also sheet 9
R: DD30.10(PC7) ; also sheet 4,7,9
RD: DD29.17(DBIN) ; also sheet 6
RES: DD12.6(A:!Q) DD29.12(RESET) DD30.35(RESET) DD112.35(RESET) ; also sheet 9
SND: DD30.12(PC5) ; also sheet 9
SNY: DD12.12(B:D) DD29.19(SYNC)
STRT: DD14.6(B:O) DD14.9(C:I0) ; also sheet 8
Unconnected: DD29.16(INTE) DD29.21(HLDA) DD29.24(WAIT)

### Buses
A[0..15],A'[11..15],D[0..7],F[1..2],G[1..19],!G19A,MA[0..7],MD[0..7],VD[0..11],K[1..27],!RAS,!CAS,CLK,!WE,!WR,X-----X,U7,!U[6..7],!RESIN,RES,RES80,RD,!RD,SNY,STRT,B,G,R,BO,GO,RO,SND,VID,LED,P[1..24],CRG,CS,!R,SH,TON,Q3,MOSI,MISO,SCK

### Notes on the sheet
- RAM

## Sheet 6 of 9: RAM
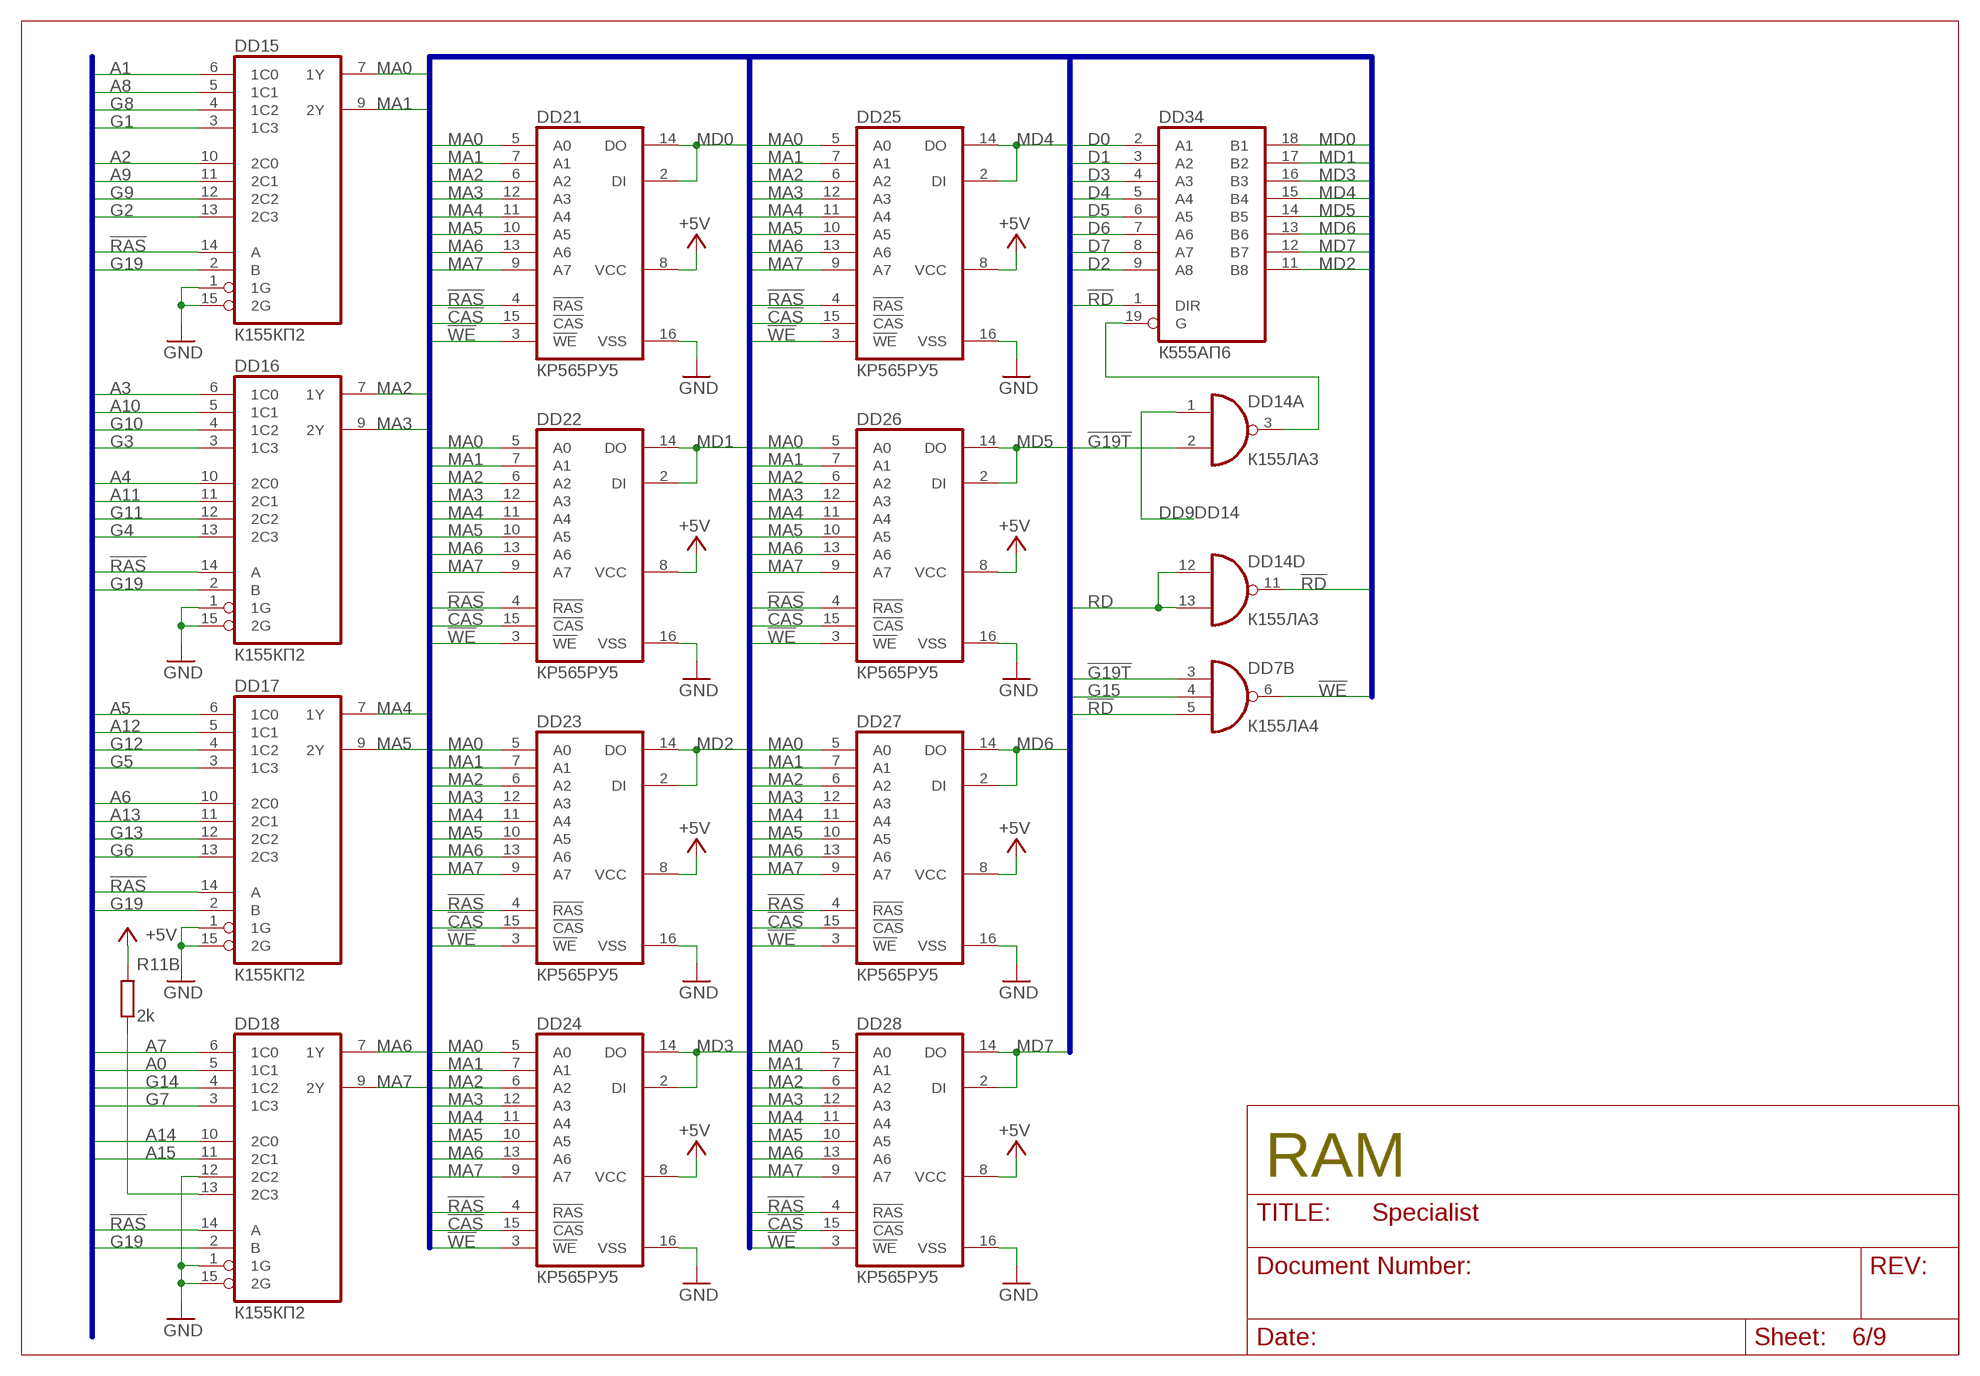
[diagram p5: schematic, sheet 6]

### Parts
DD21  КР565РУ5  2164  [DIL16]
DD22  КР565РУ5  2164  [DIL16]
DD23  КР565РУ5  2164  [DIL16]
DD24  КР565РУ5  2164  [DIL16]
DD25  КР565РУ5  2164  [DIL16]
DD26  КР565РУ5  2164  [DIL16]
DD27  КР565РУ5  2164  [DIL16]
DD28  КР565РУ5  2164  [DIL16]
R11B  2k  R-EU_M1206  [M1206]

### Nets
!CAS: DD21.15(!CAS) DD22.15(!CAS) DD23.15(!CAS) DD24.15(!CAS) DD25.15(!CAS) DD26.15(!CAS) DD27.15(!CAS) DD28.15(!CAS) ; also sheet 3,4
!G19T: DD7.3(B:I0) DD14.2(A:I1) ; also sheet 5
!RAS: DD15.14(A) DD16.14(A) DD17.14(A) DD18.14(A) DD21.4(!RAS) DD22.4(!RAS) DD23.4(!RAS) DD24.4(!RAS) DD25.4(!RAS) DD26.4(!RAS) DD27.4(!RAS) DD28.4(!RAS) ; also sheet 3,4
!RD: DD7.5(B:I2) DD14.11(D:O) DD34.1(DIR) ; also sheet 5,9
!WE: DD7.6(B:O) DD21.3(!WE) DD22.3(!WE) DD23.3(!WE) DD24.3(!WE) DD25.3(!WE) DD26.3(!WE) DD27.3(!WE) DD28.3(!WE) ; also sheet 4
+5V: DD21.8(VCC) DD22.8(VCC) DD23.8(VCC) DD24.8(VCC) DD25.8(VCC) DD26.8(VCC) DD27.8(VCC) DD28.8(VCC) R11B.2 ; also sheet 2,3,4,5,8,9
A0: DD18.5(1C1) ; also sheet 5,9
A1: DD15.6(1C0) ; also sheet 5,9
A2: DD15.10(2C0) ; also sheet 5
A3: DD16.6(1C0) ; also sheet 5
A4: DD16.10(2C0) ; also sheet 5
A5: DD17.6(1C0) ; also sheet 5
A6: DD17.10(2C0) ; also sheet 5
A7: DD18.6(1C0) ; also sheet 5
A8: DD15.5(1C1) ; also sheet 5
A9: DD15.11(2C1) ; also sheet 5
A10: DD16.5(1C1) ; also sheet 5
A11: DD16.11(2C1) ; also sheet 5,8
A12: DD17.5(1C1) ; also sheet 5,8
A13: DD17.11(2C1) ; also sheet 5,8
A14: DD18.10(2C0) ; also sheet 5,8
A15: DD18.11(2C1) ; also sheet 5,8
D0: DD34.2(A1) ; also sheet 5,9
D1: DD34.3(A2) ; also sheet 5,9
D2: DD34.9(A8) ; also sheet 5,9
D3: DD34.4(A3) ; also sheet 5,9
D4: DD34.5(A4) ; also sheet 5,9
D5: DD34.6(A5) ; also sheet 5,9
D6: DD34.7(A6) ; also sheet 5,9
D7: DD34.8(A7) ; also sheet 5,9
DD9DD14: DD14.1(A:I0) ; also sheet 8
G1: DD15.3(1C3) ; also sheet 3
G2: DD15.13(2C3) ; also sheet 3
G3: DD16.3(1C3) ; also sheet 3
G4: DD16.13(2C3) ; also sheet 3
G5: DD17.3(1C3) ; also sheet 2,3
G6: DD17.13(2C3) ; also sheet 3
G7: DD18.3(1C3) ; also sheet 3
G8: DD15.4(1C2) ; also sheet 3
G9: DD15.12(2C2) ; also sheet 3
G10: DD16.4(1C2) ; also sheet 3
G11: DD16.12(2C2) ; also sheet 3
G12: DD17.4(1C2) ; also sheet 3
G13: DD17.12(2C2) ; also sheet 3
G14: DD18.4(1C2) ; also sheet 3
G15: DD7.4(B:I1) ; also sheet 3
G19: DD15.2(B) DD16.2(B) DD17.2(B) DD18.2(B) ; also sheet 4,5
GND: DD15.1(1G) DD15.15(2G) DD16.1(1G) DD16.15(2G) DD17.1(1G) DD17.15(2G) DD18.1(1G) DD18.12(2C2) DD18.15(2G) DD21.16(VSS) DD22.16(VSS) DD23.16(VSS) DD24.16(VSS) DD25.16(VSS) DD26.16(VSS) DD27.16(VSS) DD28.16(VSS) ; also sheet 2,3,4,5,8,9
MA0: DD15.7(1Y) DD21.5(A0) DD22.5(A0) DD23.5(A0) DD24.5(A0) DD25.5(A0) DD26.5(A0) DD27.5(A0) DD28.5(A0) ; also sheet 4
MA1: DD15.9(2Y) DD21.7(A1) DD22.7(A1) DD23.7(A1) DD24.7(A1) DD25.7(A1) DD26.7(A1) DD27.7(A1) DD28.7(A1) ; also sheet 4
MA2: DD16.7(1Y) DD21.6(A2) DD22.6(A2) DD23.6(A2) DD24.6(A2) DD25.6(A2) DD26.6(A2) DD27.6(A2) DD28.6(A2) ; also sheet 4
MA3: DD16.9(2Y) DD21.12(A3) DD22.12(A3) DD23.12(A3) DD24.12(A3) DD25.12(A3) DD26.12(A3) DD27.12(A3) DD28.12(A3) ; also sheet 4
MA4: DD17.7(1Y) DD21.11(A4) DD22.11(A4) DD23.11(A4) DD24.11(A4) DD25.11(A4) DD26.11(A4) DD27.11(A4) DD28.11(A4) ; also sheet 4
MA5: DD17.9(2Y) DD21.10(A5) DD22.10(A5) DD23.10(A5) DD24.10(A5) DD25.10(A5) DD26.10(A5) DD27.10(A5) DD28.10(A5) ; also sheet 4
MA6: DD18.7(1Y) DD21.13(A6) DD22.13(A6) DD23.13(A6) DD24.13(A6) DD25.13(A6) DD26.13(A6) DD27.13(A6) DD28.13(A6) ; also sheet 4
MA7: DD18.9(2Y) DD21.9(A7) DD22.9(A7) DD23.9(A7) DD24.9(A7) DD25.9(A7) DD26.9(A7) DD27.9(A7) DD28.9(A7) ; also sheet 4
MD0: DD21.2(DI) DD21.14(DO) DD34.18(B1) ; also sheet 4
MD1: DD22.2(DI) DD22.14(DO) DD34.17(B2) ; also sheet 4
MD2: DD23.2(DI) DD23.14(DO) DD34.11(B8) ; also sheet 4
MD3: DD24.2(DI) DD24.14(DO) DD34.16(B3) ; also sheet 4
MD4: DD25.2(DI) DD25.14(DO) DD34.15(B4) ; also sheet 4
MD5: DD26.2(DI) DD26.14(DO) DD34.14(B5) ; also sheet 4
MD6: DD27.2(DI) DD27.14(DO) DD34.13(B6) ; also sheet 4
MD7: DD28.2(DI) DD28.14(DO) DD34.12(B7) ; also sheet 4
N$67: DD18.13(2C3) R11B.1
N$69: DD14.3(A:O) DD34.19(G)
RD: DD14.12(D:I0) DD14.13(D:I1) ; also sheet 5

### Buses
A[0..15],A'[11..15],D[0..7],F[1..2],G[1..19],!G19A,MA[0..7],MD[0..7],VD[0..11],K[1..27],!RAS,!CAS,CLK,!WE,!WR,X-----X,U7,!U[6..7],!RESIN,RES,RES80,RD,!RD,SNY,STRT,B,G,R,BO,GO,RO,SND,VID,LED,P[1..24],CRG,CS,!R,SH,TON,Q3,MOSI,MISO,SCK

### Notes on the sheet
- RAM

## Sheet 7 of 9: RAMM
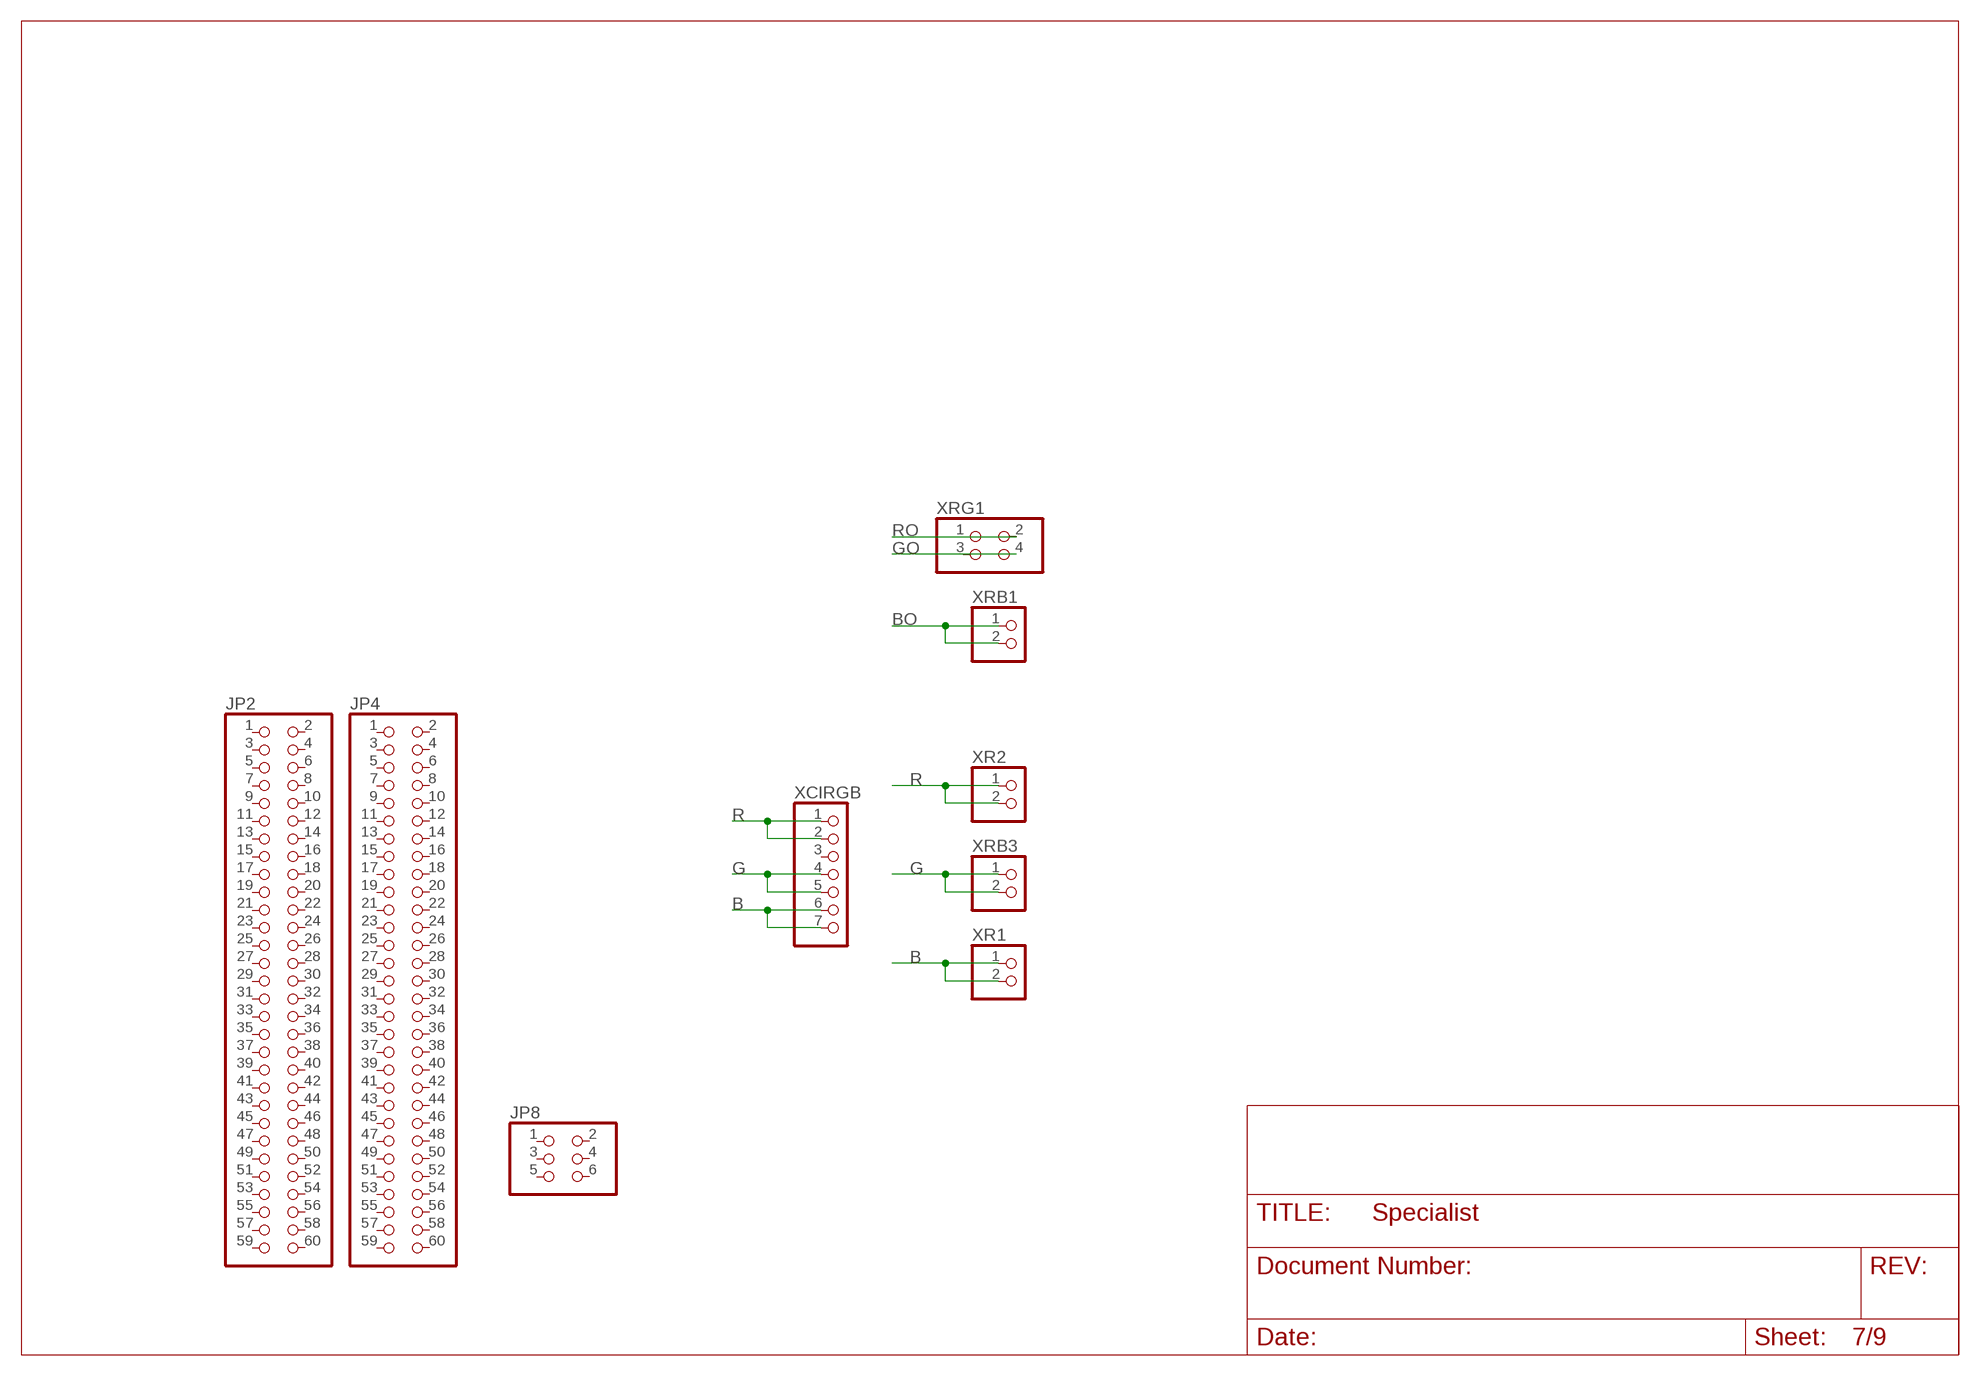
[diagram p6: schematic, sheet 7]

### Parts
JP2  PINHD-2X30  [2X30]
JP4  PINHD-2X30  [2X30]
JP8  PINHD-2X3  [2X03]
XCIRGB  PINHD-1X7  [1X07]
XR1  PINHD-1X2  [2X01]
XR2  PINHD-1X2  [2X01]
XRB1  PINHD-1X2  [2X01]
XRB3  PINHD-1X2  [2X01]
XRG1  PINHD-2X2  [2X02]

### Nets
B: XCIRGB.6 XCIRGB.7 XR1.1 XR1.2 ; also sheet 4,5,9
BO: XRB1.1 XRB1.2 ; also sheet 4
G: XCIRGB.4 XCIRGB.5 XRB3.1 XRB3.2 ; also sheet 4,5,9
GO: XRG1.3 XRG1.4 ; also sheet 4
R: XCIRGB.1 XCIRGB.2 XR2.1 XR2.2 ; also sheet 4,5,9
RO: XRG1.1 XRG1.2 ; also sheet 4
Unconnected: JP2.1 JP2.2 JP2.3 JP2.4 JP2.5 JP2.6 JP2.7 JP2.8 JP2.9 JP2.10 JP2.11 JP2.12 JP2.13 JP2.14 JP2.15 JP2.16 JP2.17 JP2.18 JP2.19 JP2.20 JP2.21 JP2.22 JP2.23 JP2.24 JP2.25 JP2.26 JP2.27 JP2.28 JP2.29 JP2.30 JP2.31 JP2.32 JP2.33 JP2.34 JP2.35 JP2.36 JP2.37 JP2.38 JP2.39 JP2.40 JP2.41 JP2.42 JP2.43 JP2.44 JP2.45 JP2.46 JP2.47 JP2.48 JP2.49 JP2.50 JP2.51 JP2.52 JP2.53 JP2.54 JP2.55 JP2.56 JP2.57 JP2.58 JP2.59 JP2.60 JP4.1 JP4.2 JP4.3 JP4.4 JP4.5 JP4.6 JP4.7 JP4.8 JP4.9 JP4.10 JP4.11 JP4.12 JP4.13 JP4.14 JP4.15 JP4.16 JP4.17 JP4.18 JP4.19 JP4.20 JP4.21 JP4.22 JP4.23 JP4.24 JP4.25 JP4.26 JP4.27 JP4.28 JP4.29 JP4.30 JP4.31 JP4.32 JP4.33 JP4.34 JP4.35 JP4.36 JP4.37 JP4.38 JP4.39 JP4.40 JP4.41 JP4.42 JP4.43 JP4.44 JP4.45 JP4.46 JP4.47 JP4.48 JP4.49 JP4.50 JP4.51 JP4.52 JP4.53 JP4.54 JP4.55 JP4.56 JP4.57 JP4.58 JP4.59 JP4.60 JP8.1 JP8.2 JP8.3 JP8.4 JP8.5 JP8.6 XCIRGB.3

## Sheet 8 of 9
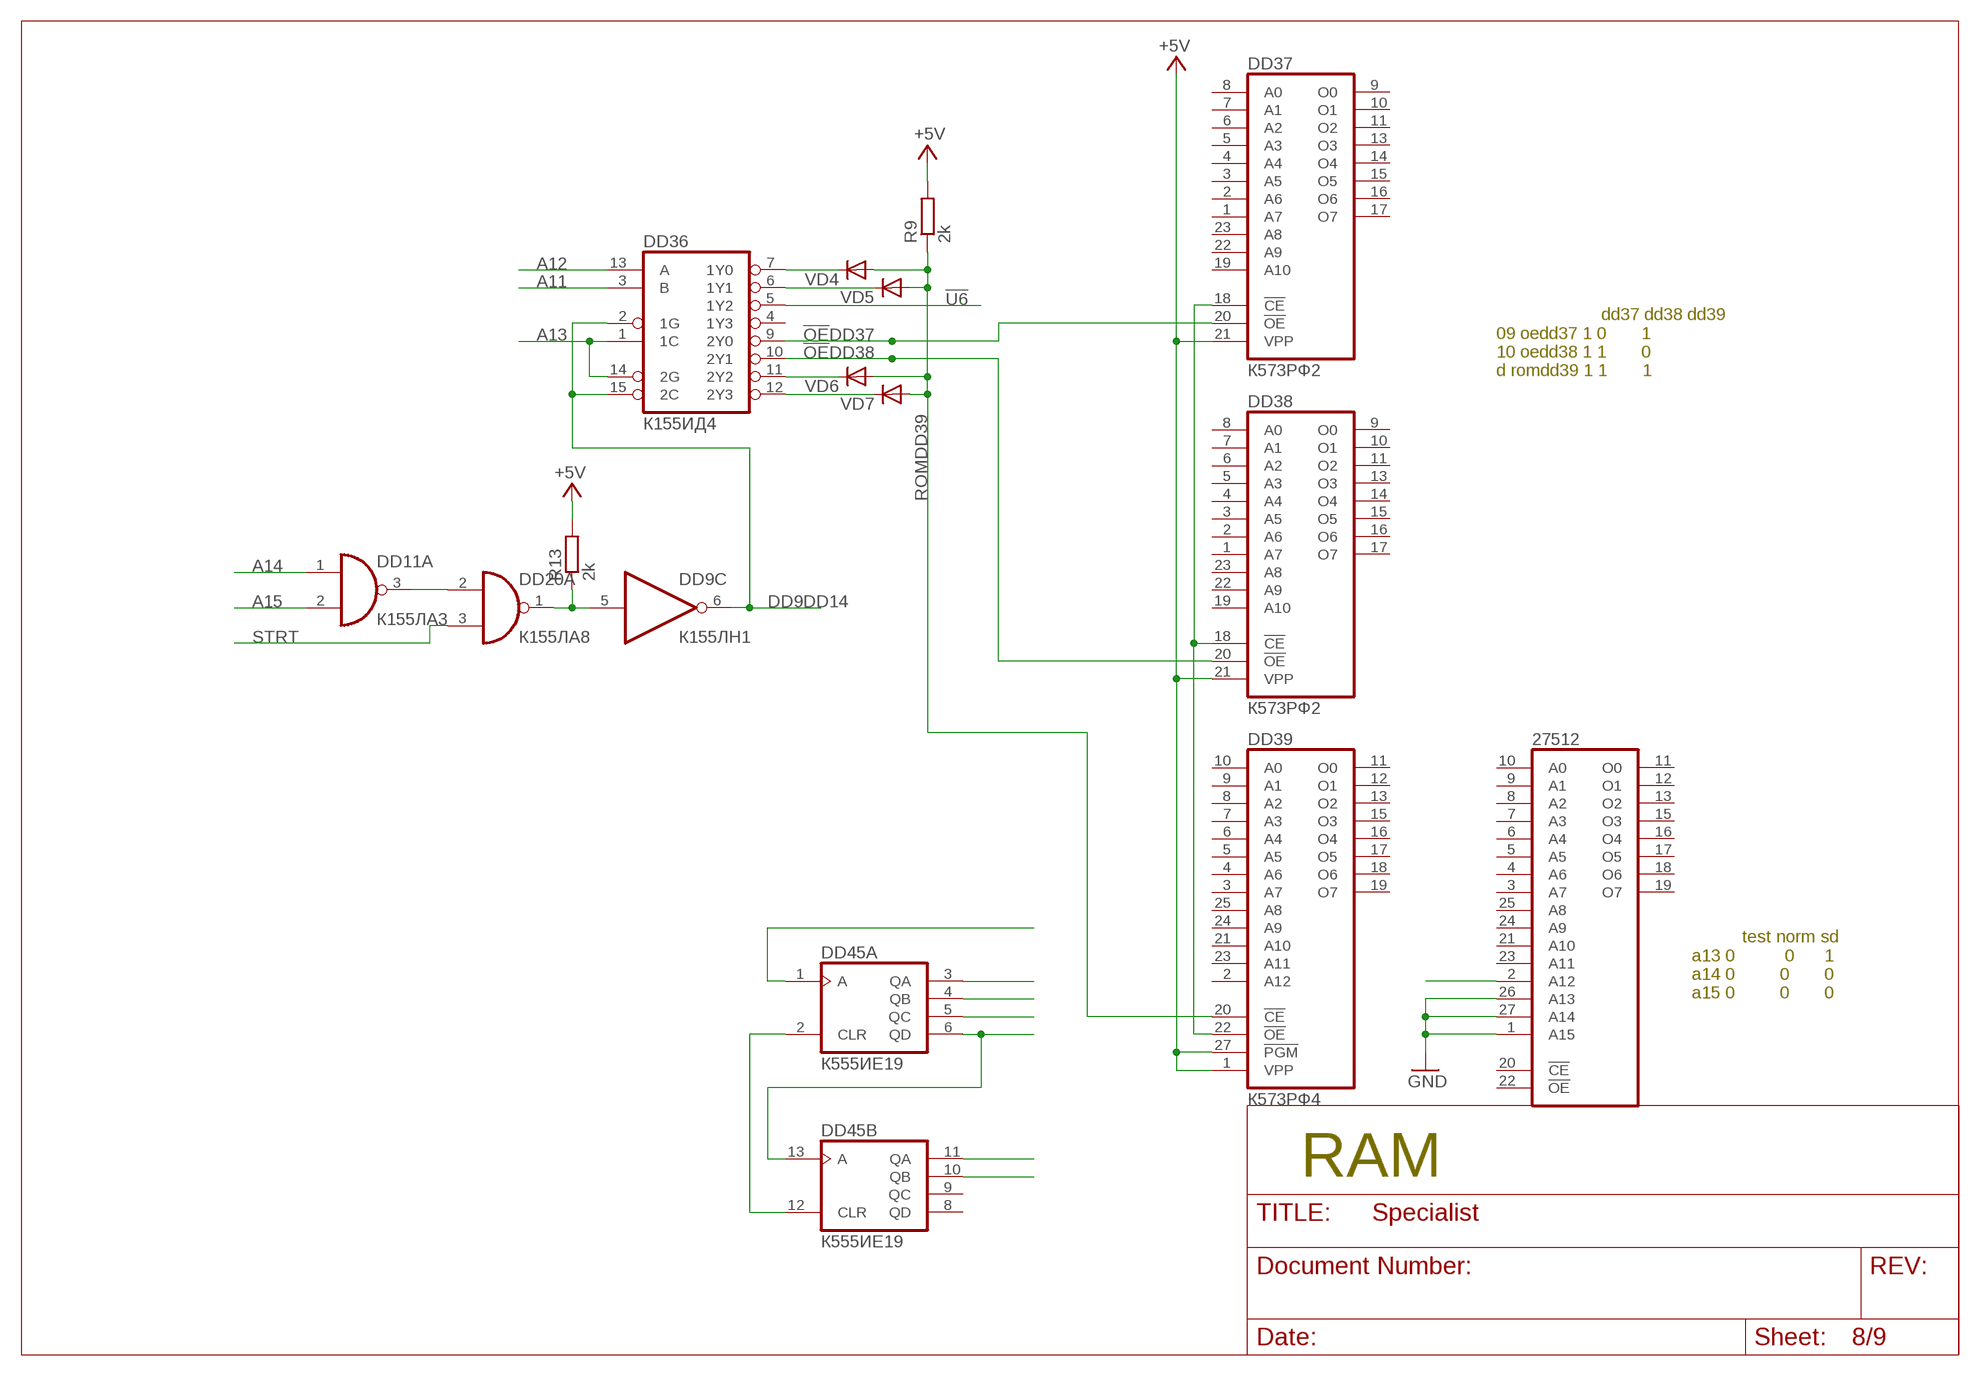
[diagram p7: schematic, sheet 8]

### Parts
27512  27512  [DIL28]
DD37  К573РФ2  2716  [DIL24]
DD38  К573РФ2  2716  [DIL24]
DD39  К573РФ4  2764  [DIL28]
DD45  К555ИЕ19  74393N  [DIL14]
R9  2k  R-EU_M1206  [M1206]
R13  2k  R-EU_M1206  [M1206]
VD4  DIODE-SOD80C  [SOD80C]
VD5  DIODE-SOD80C  [SOD80C]
VD6  DIODE-SOD80C  [SOD80C]
VD7  DIODE-SOD80C  [SOD80C]

### Nets
!OE!DD37: DD36.9(2Y0) DD37.20(!OE)
!OE!DD38: DD36.10(2Y1) DD38.20(!OE)
!U6: DD36.5(1Y2) ; also sheet 5,9
+5V: DD37.21(VPP) DD38.21(VPP) DD39.1(VPP) DD39.27(!PGM) R9.2 R13.2 ; also sheet 2,3,4,5,6,9
A11: DD36.3(B) ; also sheet 5,6
A12: DD36.13(A) ; also sheet 5,6
A13: DD36.1(1C) DD36.14(2G) ; also sheet 5,6
A14: DD11.1(A:I0) ; also sheet 5,6
A15: DD11.2(A:I1) ; also sheet 5,6
DD9DD14: DD9.6(C:O) DD36.2(1G) DD36.15(2C) ; also sheet 6
GND: 27512.1(A15) 27512.26(A13) 27512.27(A14) ; also sheet 2,3,4,5,6,9
N$9: DD36.7(1Y0) VD4.C
N$10: DD36.6(1Y1) VD5.C
N$15: DD36.11(2Y2) VD6.C
N$17: DD36.12(2Y3) VD7.C
N$18: 27512.2(A12)
N$30: DD45.3(A:QA)
N$32: DD45.6(A:QD) DD45.13(B:A)
N$33: DD37.18(!CE) DD38.18(!CE) DD39.22(!OE)
N$44: DD11.3(A:O) DD20.2(A:I0)
N$47: DD45.4(A:QB)
N$53: DD9.5(C:I) DD20.1(A:O) R13.1
N$61: DD45.5(A:QC)
N$62: DD45.11(B:QA)
N$63: DD45.10(B:QB)
N$64: DD45.1(A:A)
N$65: DD45.2(A:CLR) DD45.12(B:CLR)
ROMDD39: DD39.20(!CE) R9.1 VD4.A VD5.A VD6.A VD7.A
STRT: DD20.3(A:I1) ; also sheet 5
Unconnected: 27512.3(A7) 27512.4(A6) 27512.5(A5) 27512.6(A4) 27512.7(A3) 27512.8(A2) 27512.9(A1) 27512.10(A0) 27512.11(O0) 27512.12(O1) 27512.13(O2) 27512.15(O3) 27512.16(O4) 27512.17(O5) 27512.18(O6) 27512.19(O7) 27512.20(!CE) 27512.21(A10) 27512.22(!OE) 27512.23(A11) 27512.24(A9) 27512.25(A8) DD36.4(1Y3) DD37.1(A7) DD37.2(A6) DD37.3(A5) DD37.4(A4) DD37.5(A3) DD37.6(A2) DD37.7(A1) DD37.8(A0) DD37.9(O0) DD37.10(O1) DD37.11(O2) DD37.13(O3) DD37.14(O4) DD37.15(O5) DD37.16(O6) DD37.17(O7) DD37.19(A10) DD37.22(A9) DD37.23(A8) DD38.1(A7) DD38.2(A6) DD38.3(A5) DD38.4(A4) DD38.5(A3) DD38.6(A2) DD38.7(A1) DD38.8(A0) DD38.9(O0) DD38.10(O1) DD38.11(O2) DD38.13(O3) DD38.14(O4) DD38.15(O5) DD38.16(O6) DD38.17(O7) DD38.19(A10) DD38.22(A9) DD38.23(A8) DD39.2(A12) DD39.3(A7) DD39.4(A6) DD39.5(A5) DD39.6(A4) DD39.7(A3) DD39.8(A2) DD39.9(A1) DD39.10(A0) DD39.11(O0) DD39.12(O1) DD39.13(O2) DD39.15(O3) DD39.16(O4) DD39.17(O5) DD39.18(O6) DD39.19(O7) DD39.21(A10) DD39.23(A11) DD39.24(A9) DD39.25(A8) DD45.8(B:QD) DD45.9(B:QC)

### Notes on the sheet
- dd37 dd38 dd39
  09 oedd37 1 0       1
  10 oedd38 1 1       0
  d romdd39 1 1       1
- test norm sd
  a13 0          0      1
  a14 0         0       0
  a15 0         0       0
- RAM

## Sheet 9 of 9: MEGA
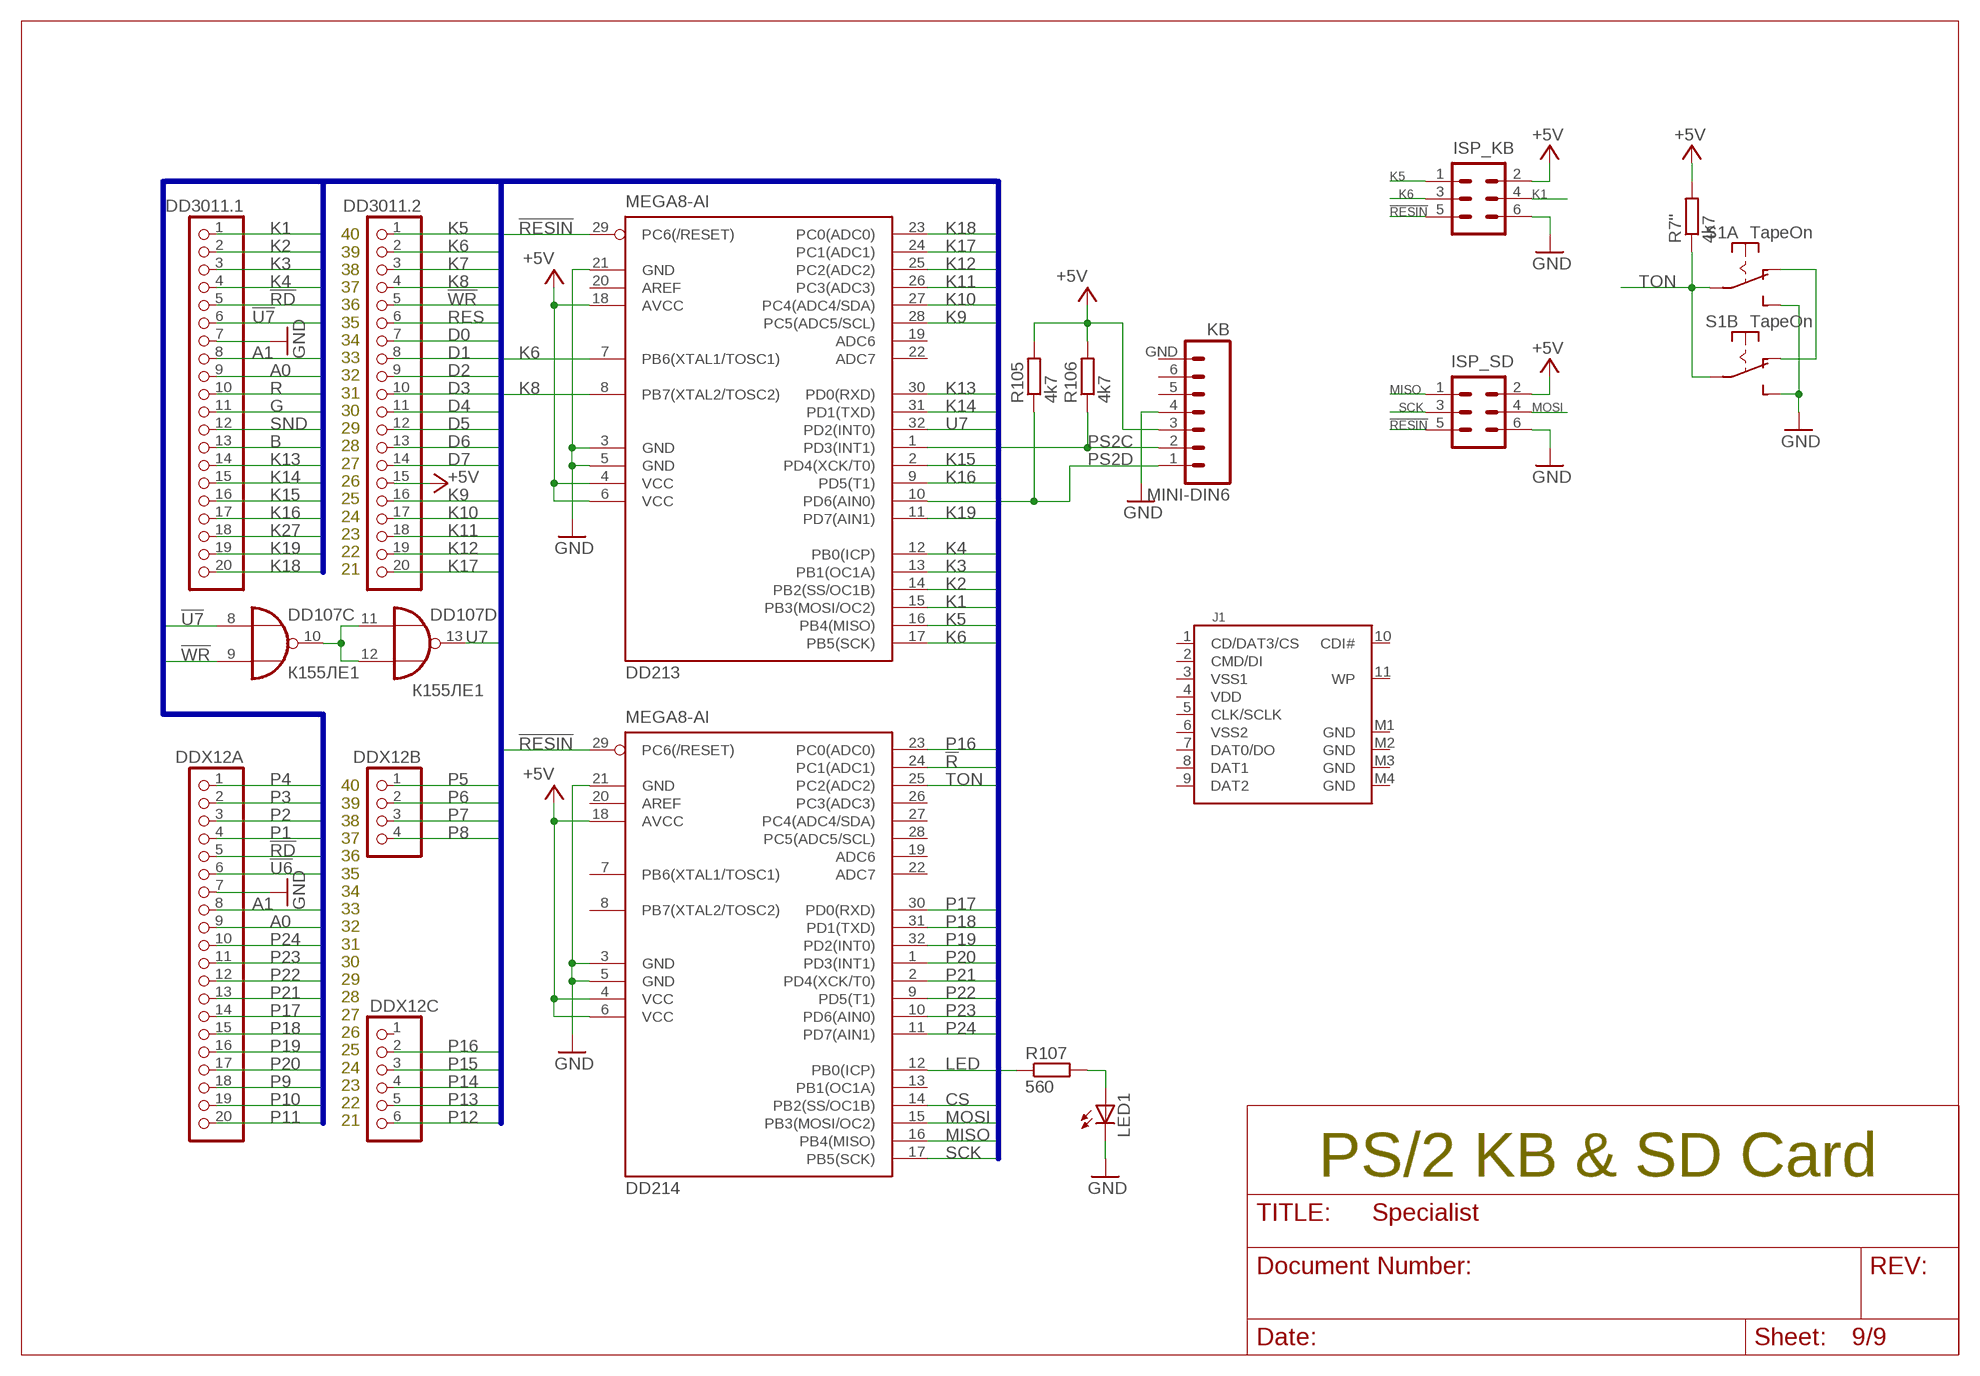
[diagram p8: schematic, sheet 9]

### Parts
DD213  MEGA8-AI  [TQFP32-08]
DD214  MEGA8-AI  [TQFP32-08]
DD3011.1  PINHD-1X20  [1X20]
DD3011.2  PINHD-1X20  [1X20]
DDX12A  PINHD-1X20  [1X20]
DDX12B  PINHD-1X4  [1X04]
DDX12C  PINHD-1X6  [1X06]
ISP_KB  MA03-2  [MA03-2]
ISP_SD  MA03-2  [MA03-2]
J1  SDCARD  [SDCMF-10915W010]
KB  MINI-DIN6  MINI-DIN6PTH  [MINI-DIN6]
LED1  LED5MM  [LED5MM]
R7''  4k7  R-EU_M0805  [M0805]
R105  4k7  R-EU_M0805  [M0805]
R106  4k7  R-EU_M0805  [M0805]
R107  560  R-EU_M0805  [M0805]
S1  TapeOn  SWITCH9X4  [SWITCH9X4]

### Nets
!R: DD214.24(PC1(ADC1))
!RD: DD3011.1.5 DDX12A.5 ; also sheet 5,6
!RESIN: DD213.29(PC6(/RESET)) DD214.29(PC6(/RESET)) ISP_KB.5 ISP_SD.5
!U6: DDX12A.6 ; also sheet 5,8
!U7: DD107.8(C:I0) DD3011.1.6 ; also sheet 5
!WR: DD107.9(C:I1) DD3011.2.5 ; also sheet 5
+5V: DD213.4(VCC) DD213.6(VCC) DD213.18(AVCC) DD214.4(VCC) DD214.6(VCC) DD214.18(AVCC) DD3011.2.15 ISP_KB.2 ISP_SD.2 KB.3 R7''.2 R105.2 R106.2 ; also sheet 2,3,4,5,6,8
A0: DD3011.1.9 DDX12A.9 ; also sheet 5,6
A1: DD3011.1.8 DDX12A.8 ; also sheet 5,6
B: DD3011.1.13 ; also sheet 4,5,7
CS: DD214.14(PB2(SS/OC1B))
D0: DD3011.2.7 ; also sheet 5,6
D1: DD3011.2.8 ; also sheet 5,6
D2: DD3011.2.9 ; also sheet 5,6
D3: DD3011.2.10 ; also sheet 5,6
D4: DD3011.2.11 ; also sheet 5,6
D5: DD3011.2.12 ; also sheet 5,6
D6: DD3011.2.13 ; also sheet 5,6
D7: DD3011.2.14 ; also sheet 5,6
G: DD3011.1.11 ; also sheet 4,5,7
GND: DD213.3(GND) DD213.5(GND) DD213.21(GND) DD214.3(GND) DD214.5(GND) DD214.21(GND) DD3011.1.7 DDX12A.7 ISP_KB.6 ISP_SD.6 KB.4 LED1.K(C) S1.12(A:S) S1.22(B:S) ; also sheet 2,3,4,5,6,8
K1: DD213.15(PB3(MOSI/OC2)) DD3011.1.1 ISP_KB.4 ; also sheet 5
K2: DD213.14(PB2(SS/OC1B)) DD3011.1.2 ; also sheet 5
K3: DD213.13(PB1(OC1A)) DD3011.1.3 ; also sheet 5
K4: DD213.12(PB0(ICP)) DD3011.1.4 ; also sheet 5
K5: DD213.16(PB4(MISO)) DD3011.2.1 ISP_KB.1 ; also sheet 5
K6: DD213.7(PB6(XTAL1/TOSC1)) DD213.17(PB5(SCK)) DD3011.2.2 ISP_KB.3 ; also sheet 5
K7: DD3011.2.3 ; also sheet 5
K8: DD213.8(PB7(XTAL2/TOSC2)) DD3011.2.4 ; also sheet 5
K9: DD213.28(PC5(ADC5/SCL)) DD3011.2.16 ; also sheet 5
K10: DD213.27(PC4(ADC4/SDA)) DD3011.2.17 ; also sheet 5
K11: DD213.26(PC3(ADC3)) DD3011.2.18 ; also sheet 5
K12: DD213.25(PC2(ADC2)) DD3011.2.19 ; also sheet 5
K13: DD213.30(PD0(RXD)) DD3011.1.14 ; also sheet 5
K14: DD213.31(PD1(TXD)) DD3011.1.15 ; also sheet 5
K15: DD213.2(PD4(XCK/T0)) DD3011.1.16 ; also sheet 5
K16: DD213.9(PD5(T1)) DD3011.1.17 ; also sheet 5
K17: DD213.24(PC1(ADC1)) DD3011.2.20 ; also sheet 5
K18: DD213.23(PC0(ADC0)) DD3011.1.20 ; also sheet 5
K19: DD213.11(PD7(AIN1)) DD3011.1.19 ; also sheet 5
K27: DD3011.1.18 ; also sheet 5
LED: DD214.12(PB0(ICP)) R107.1
MISO: DD214.16(PB4(MISO)) ISP_SD.1
MOSI: DD214.15(PB3(MOSI/OC2)) ISP_SD.4
N$35: S1.11(A:O) S1.21(B:O)
N$40: DD107.10(C:O) DD107.11(D:I0) DD107.12(D:I1)
N$48: LED1.A R107.2
P1: DDX12A.4 ; also sheet 5
P2: DDX12A.3 ; also sheet 5
P3: DDX12A.2 ; also sheet 5
P4: DDX12A.1 ; also sheet 5
P5: DDX12B.1 ; also sheet 5
P6: DDX12B.2 ; also sheet 5
P7: DDX12B.3 ; also sheet 5
P8: DDX12B.4 ; also sheet 5
P9: DDX12A.18 ; also sheet 5
P10: DDX12A.19 ; also sheet 5
P11: DDX12A.20 ; also sheet 5
P12: DDX12C.6 ; also sheet 5
P13: DDX12C.5 ; also sheet 5
P14: DDX12C.4 ; also sheet 5
P15: DDX12C.3 ; also sheet 5
P16: DD214.23(PC0(ADC0)) DDX12C.2 ; also sheet 5
P17: DD214.30(PD0(RXD)) DDX12A.14 ; also sheet 5
P18: DD214.31(PD1(TXD)) DDX12A.15 ; also sheet 5
P19: DD214.32(PD2(INT0)) DDX12A.16 ; also sheet 5
P20: DD214.1(PD3(INT1)) DDX12A.17 ; also sheet 5
P21: DD214.2(PD4(XCK/T0)) DDX12A.13 ; also sheet 5
P22: DD214.9(PD5(T1)) DDX12A.12 ; also sheet 5
P23: DD214.10(PD6(AIN0)) DDX12A.11 ; also sheet 5
P24: DD214.11(PD7(AIN1)) DDX12A.10 ; also sheet 5
PS2C: DD213.1(PD3(INT1)) KB.2 R106.1
PS2D: DD213.10(PD6(AIN0)) KB.1 R105.1
R: DD3011.1.10 ; also sheet 4,5,7
RES: DD3011.2.6 ; also sheet 5
SCK: DD214.17(PB5(SCK)) ISP_SD.3
SND: DD3011.1.12 ; also sheet 5
TON: DD214.25(PC2(ADC2)) R7''.1 S1.10(A:P) S1.20(B:P)
U7: DD107.13(D:O) DD213.32(PD2(INT0))
Unconnected: DD213.19(ADC6) DD213.20(AREF) DD213.22(ADC7) DD214.7(PB6(XTAL1/TOSC1)) DD214.8(PB7(XTAL2/TOSC2)) DD214.13(PB1(OC1A)) DD214.19(ADC6) DD214.20(AREF) DD214.22(ADC7) DD214.26(PC3(ADC3)) DD214.27(PC4(ADC4/SDA)) DD214.28(PC5(ADC5/SCL)) DDX12C.1 J1.1(CD/DAT3/CS) J1.2(CMD/DI) J1.5(CLK/SCLK) J1.7(DAT0/DO) J1.8(DAT1) J1.9(DAT2) J1.10(CDI#) J1.11(WP) KB.5 KB.6 KB.GND

### Buses
A[0..15],A'[11..15],D[0..7],F[1..2],G[1..19],!G19A,MA[0..7],MD[0..7],VD[0..11],K[1..27],!RAS,!CAS,CLK,!WE,!WR,X-----X,U7,!U[6..7],!RESIN,RES,RES80,RD,!RD,SNY,STRT,B,G,R,BO,GO,RO,SND,VID,LED,P[1..24],CRG,CS,!R,SH,TON,Q3,MOSI,MISO,SCK

### Notes on the sheet
- 40
  39
  38
  37
  36
  35
  34
  33
  32
  31
  30
  29
  28
  27
  26
  25
  24
  23
  22
  21
- 40
  39
  38
  37
  36
  35
  34
  33
  32
  31
  30
  29
  28
  27
  26
  25
  24
  23
  22
  21
- PS/2 KB & SD Card

## Power pins joined to a net without a drawn wire
GND: 27512.14(GND) DD37.12(GND) DD38.12(GND) DD39.14(GND) DD45.7(P:GND) J1.M1(GND) J1.M2(GND) J1.M3(GND) J1.M4(GND)
VCC: 27512.28(VCC) DD37.24(VCC) DD38.24(VCC) DD39.28(VCC) DD45.14(P:VCC)
VDD: J1.4(VDD)
VSS1: J1.3(VSS1)
VSS2: J1.6(VSS2)

## Library data of the parts
27512 = memory:27512: MEMORY
C1 C4 C4' C5 C6 C11 = rcl:C-EU: CAPACITOR, European symbol
C3 C7 C10 = rcl:CPOL-EU: POLARIZED CAPACITOR, European symbol
DD1 DD9 = 74xx-eu:74*04: Hex INVERTER
DD2 DD8 = 74xx-eu:74*192: Synchronous 4-bit UP/DOWN COUNTER
DD3-DD5 = 74xx-eu:74*93: Decade, divide by twelve and binary COUNTER
DD6 DD107 DD110 = 74xx-eu:74*02: Quad 2-input NOR gate
DD7 = 74xx-eu:74*10: Triple 3-input NAND gate
DD10 = 74xx-eu:74*30: 8-input NAND gate
DD11 DD14 = 74xx-eu:74*00: Quad 2-input NAND gate
DD12 = 74xx-eu:74*74: Dual D type positive edge triggered FLIP FLOP, preset and clear
DD15-DD18 = 74xx-eu:74*153: Dual 4-line to 1-line data SELECTOR/MULTIPLEXER
DD19 = 74xx-eu:74*365: Hex BUS DRIVER, 3-state
DD20 = 74xx-eu:74*01: Quad 2-input NAND gate, open collector
DD21-DD28 DD102-DD104 = memory:2164: MEMORY
DD29 = micro-intel:8080: MICROCOMPUTER/PERIPHERAL DEVICE; OC_FARNELL: unknown; OC_NEWARK: unknown
DD30 DD112 = micro-intel:8255A: MICROCOMPUTER/PERIPHERAL DEVICE; OC_FARNELL: unknown; OC_NEWARK: unknown
DD31 DD108 = 74xx-eu:74*373: Octal D type transparent LATCH, edge triggered
DD32 DD33 DD109 = 74xx-eu:74*95: 4-bit parallel access SHIFT REGISTER
DD34 = 74xx-eu:74*245: Octal BUS TRANSCEIVER, 3-state
DD36 DD40 = 74xx-eu:74*155: Dual 2-line to 4-line data DECODER/DEMULTIPLEXER
DD37 DD38 = memory:2716: MEMORY
DD39 = memory:2764: MEMORY
DD45 = 74xx-eu:74*393: Dual 4-bit decade and binary COUNTER
DD213 DD214 = atmel:MEGA8: MICROCONTROLLER 8 Kbytes FLASH, 1 kbytes SRAM, 512 bytes EEPROM, USART, 6-channel 10 bit ADC, 2-channel 8 bit ADC Pin compatible with Atmega48, ATMega88, ATMega168 Source: avr.lbr; MPN: ATMEGA8-16AU; OC_FARNELL: 9171371; OC_NEWARK: 73M8863
DD3011.1 DD3011.2 DDX12A = Разъёмы штырьковые 2.54мм:PINHD-1X20: PIN HEADER
DDX12B = Разъёмы штырьковые 2.54мм:PINHD-1X4: PIN HEADER
DDX12C = Разъёмы штырьковые 2.54мм:PINHD-1X6: PIN HEADER
ISP_KB ISP_SD = con-lstb:MA03-2: PIN HEADER
J1 = Speccy:SDCARD: SD card connector KINGFONT SDCMF-10915W010
JP1 = Разъёмы штырьковые 2.54мм:PINHD-1X1: PIN HEADER
JP2 JP4 = Разъёмы штырьковые 2.54мм:PINHD-2X30: PIN HEADER
JP8 = Разъёмы штырьковые 2.54мм:PINHD-2X3: PIN HEADER
KB = Speccy:MINI-DIN6: mini DIN 6 Connector Commonly found on the back of a computer for PS2 keyboard and mice. Schematic and footprint are proven. Spark Fun Electronics SKU : PRT-08509
LED1 = led:LED: LED OSRAM: - CHIPLED LG R971, LG N971, LY N971, LG Q971, LY Q971, LO R971, LY R971 LH N974, LH R974 LS Q976, LO Q976, LY Q976 LO Q996 - Hyper CHIPLED LW Q18S LB Q993, LB Q99A, LB R99A - SideLED LS A670, LO A670, LY A670, LG A670, LP A670 LB A673, LV A673, LT A673, LW A673 LH A674 LY A675 LS A676, LA A676, LO A676, LY A676, LW A676 LS A679, LY A679, LG A679 - Hyper Micro SIDELED® LS Y876, LA Y876, LO Y876, LY Y876 LT Y87S - SmartLED LW L88C, LW L88S LB L89C, LB L89S, LG L890 LS L89K, LO L89K, LY L89K LS L896, LA L896, LO L896, LY L896 - TOPLED LS T670, LO T670, LY T670, LG T670, LP T670 LSG T670, LSP T670, LSY T670, LOP T670, LYG T670 LG T671, LOG T671, LSG T671 LB T673, LV T673, LT T673, LW T673 LH T674 LS T676, LA T676, LO T676, LY T676, LB T676, LH T676, LSB T676, LW T676 LB T67C, LV T67C, LT T67C, LS T67K, LO T67K, LY T67K, LW E67C LS E67B, LA E67B, LO E67B, LY E67B, LB E67C, LV E67C, LT E67C LW T67C LS T679, LY T679, LG T679 LS T770, LO T770, LY T770, LG T770, LP T770 LB T773, LV T773, LT T773, LW T773 LH T774 LS E675, LA E675, LY E675, LS T675 LS T776, LA T776, LO T776, LY T776, LB T776 LHGB T686 LT T68C, LB T68C - Hyper Mini TOPLED® LB M676 - Mini TOPLED Santana® LG M470 LS M47K, LO M47K, LY M47K Source: http://www.osram.convergy.de LUXEON: - LUMILED® LXK2-PW12-R00, LXK2-PW12-S00, LXK2-PW14-U00, LXK2-PW14-V00 LXK2-PM12-R00, LXK2-PM12-S00, LXK2-PM14-U00 LXK2-PE12-Q00, LXK2-PE12-R00, LXK2-PE12-S00, LXK2-PE14-T00, LXK2-PE14-U00 LXK2-PB12-K00, LXK2-PB12-L00, LXK2-PB12-M00, LXK2-PB14-N00, LXK2-PB14-P00, LXK2-PB14-Q00 LXK2-PR12-L00, LXK2-PR12-M00, LXK2-PR14-Q00, LXK2-PR14-R00 LXK2-PD12-Q00, LXK2-PD12-R00, LXK2-PD12-S00 LXK2-PH12-R00, LXK2-PH12-S00 LXK2-PL12-P00, LXK2-PL12-Q00, LXK2-PL12-R00 Source: www.luxeon.com KINGBRIGHT: KA-3528ASYC Source: www.kingbright.com
R1-R6 R7'' R9-R11 R11B R13 R14 R23 R47 R48 R105-R107 RD1 RD2 = rcl:R-EU_: RESISTOR, European symbol
R101-R103 = rcl:R-TRIMM: Trimm resistor
S1 = ESR_NM8032:SWITCH9X4
VD1 VD2 VD4-VD7 VD9 VD10 = diode:DIODE-: DIODE
VD3 VD3* = diode:ZENER-DIODE: Z-Diode
VD8 = diode:1N4004: DIODE general purpose rectifier, 1 A
X1 = con-hirschmann:SCART-F: TV SCART CONNECTOR; OC_FARNELL: unknown; OC_NEWARK: unknown
XCIRGB = Разъёмы штырьковые 2.54мм:PINHD-1X7: PIN HEADER
XR1 XR2 XRB XRB1 XRB3 = Разъёмы штырьковые 2.54мм:PINHD-1X2: PIN HEADER
XRG XRG1 = Разъёмы штырьковые 2.54мм:PINHD-2X2: PIN HEADER
Z1 = crystal:CRYSTAL: CRYSTAL; OC_FARNELL: 1667008; OC_NEWARK: unknown